# EAGLE schematic Led_Driver (EAGLE 6.4), part 1 of 2
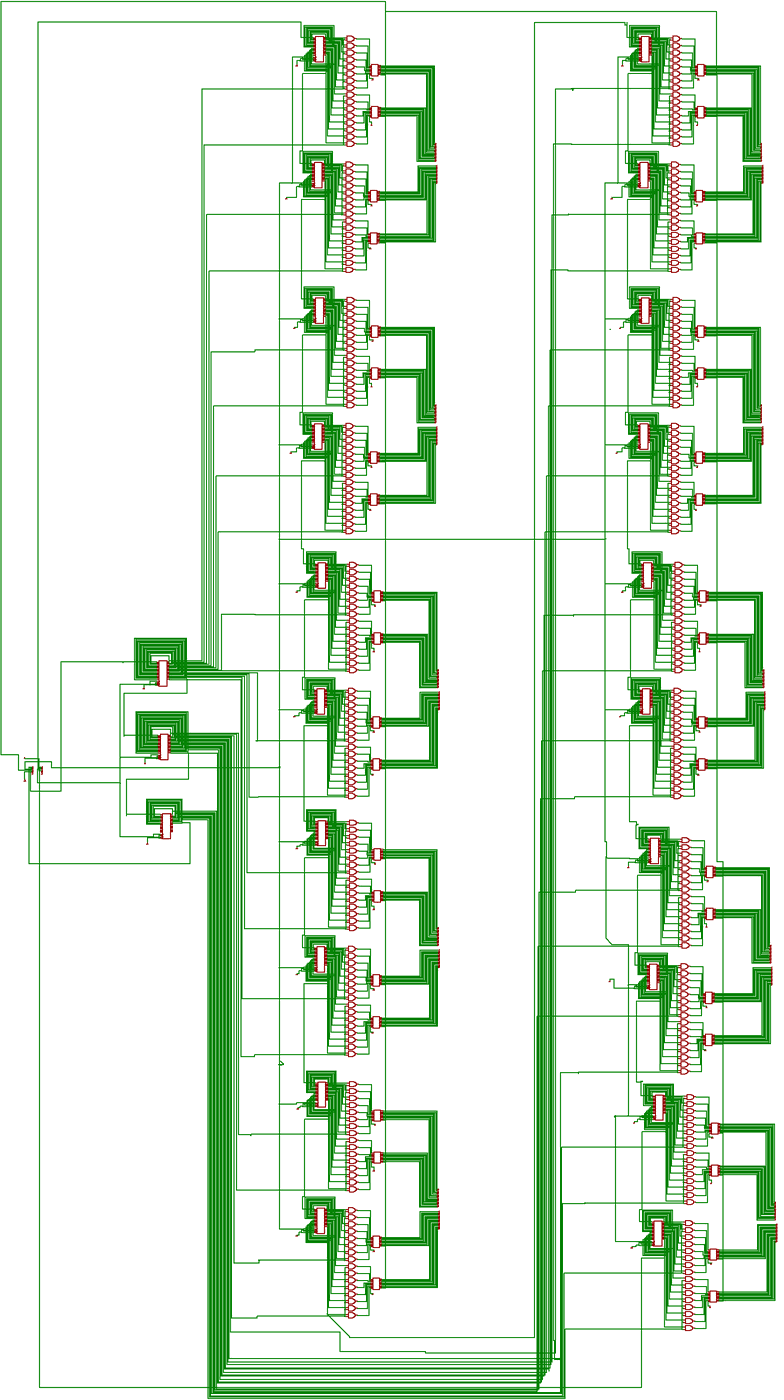
[diagram p0: schematic, sheet 1, overview]
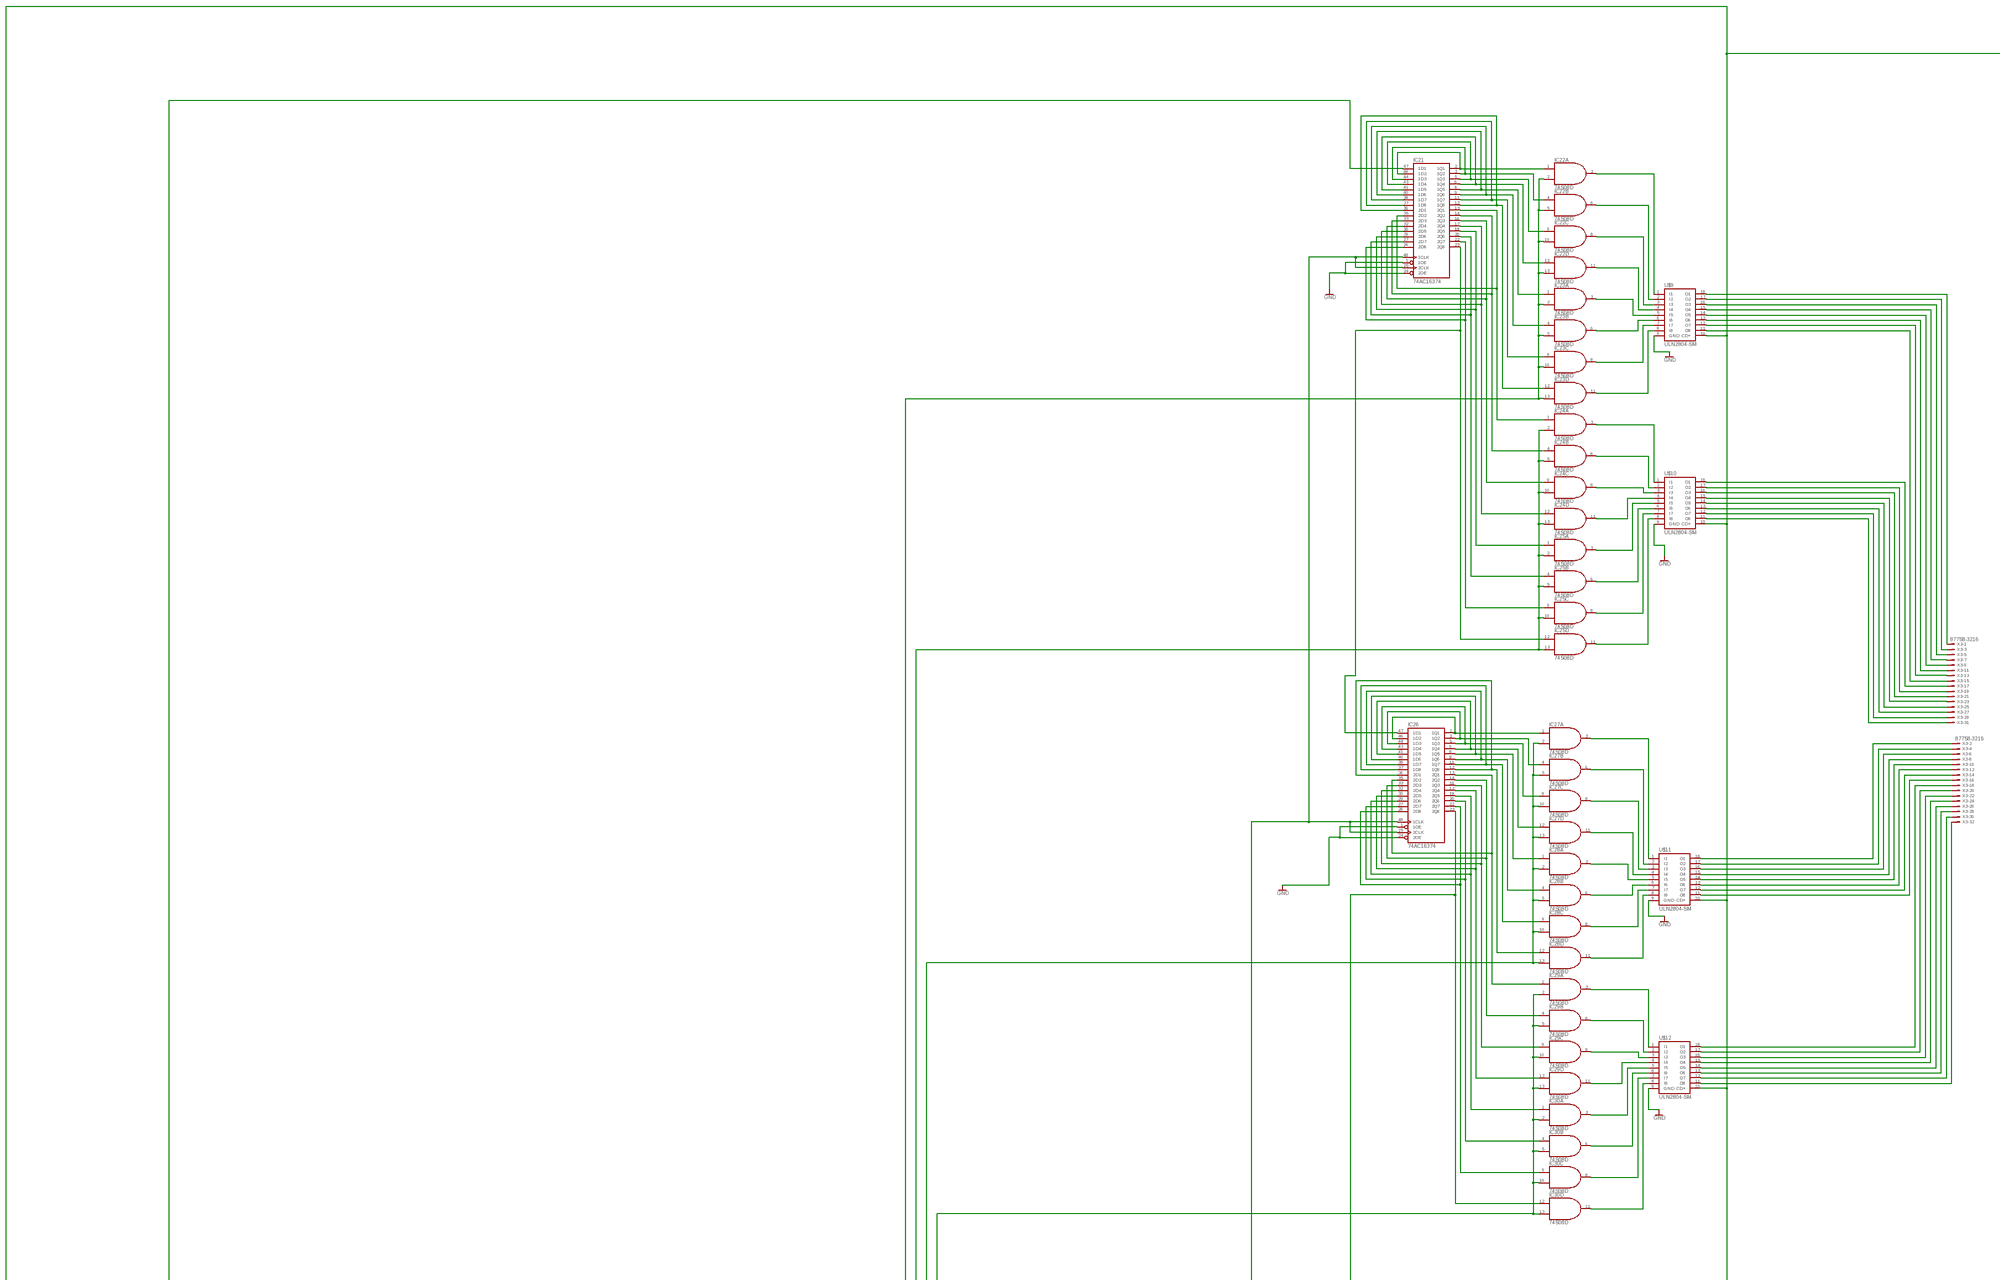
[diagram p1: schematic, sheet 1, part 1 of 8]
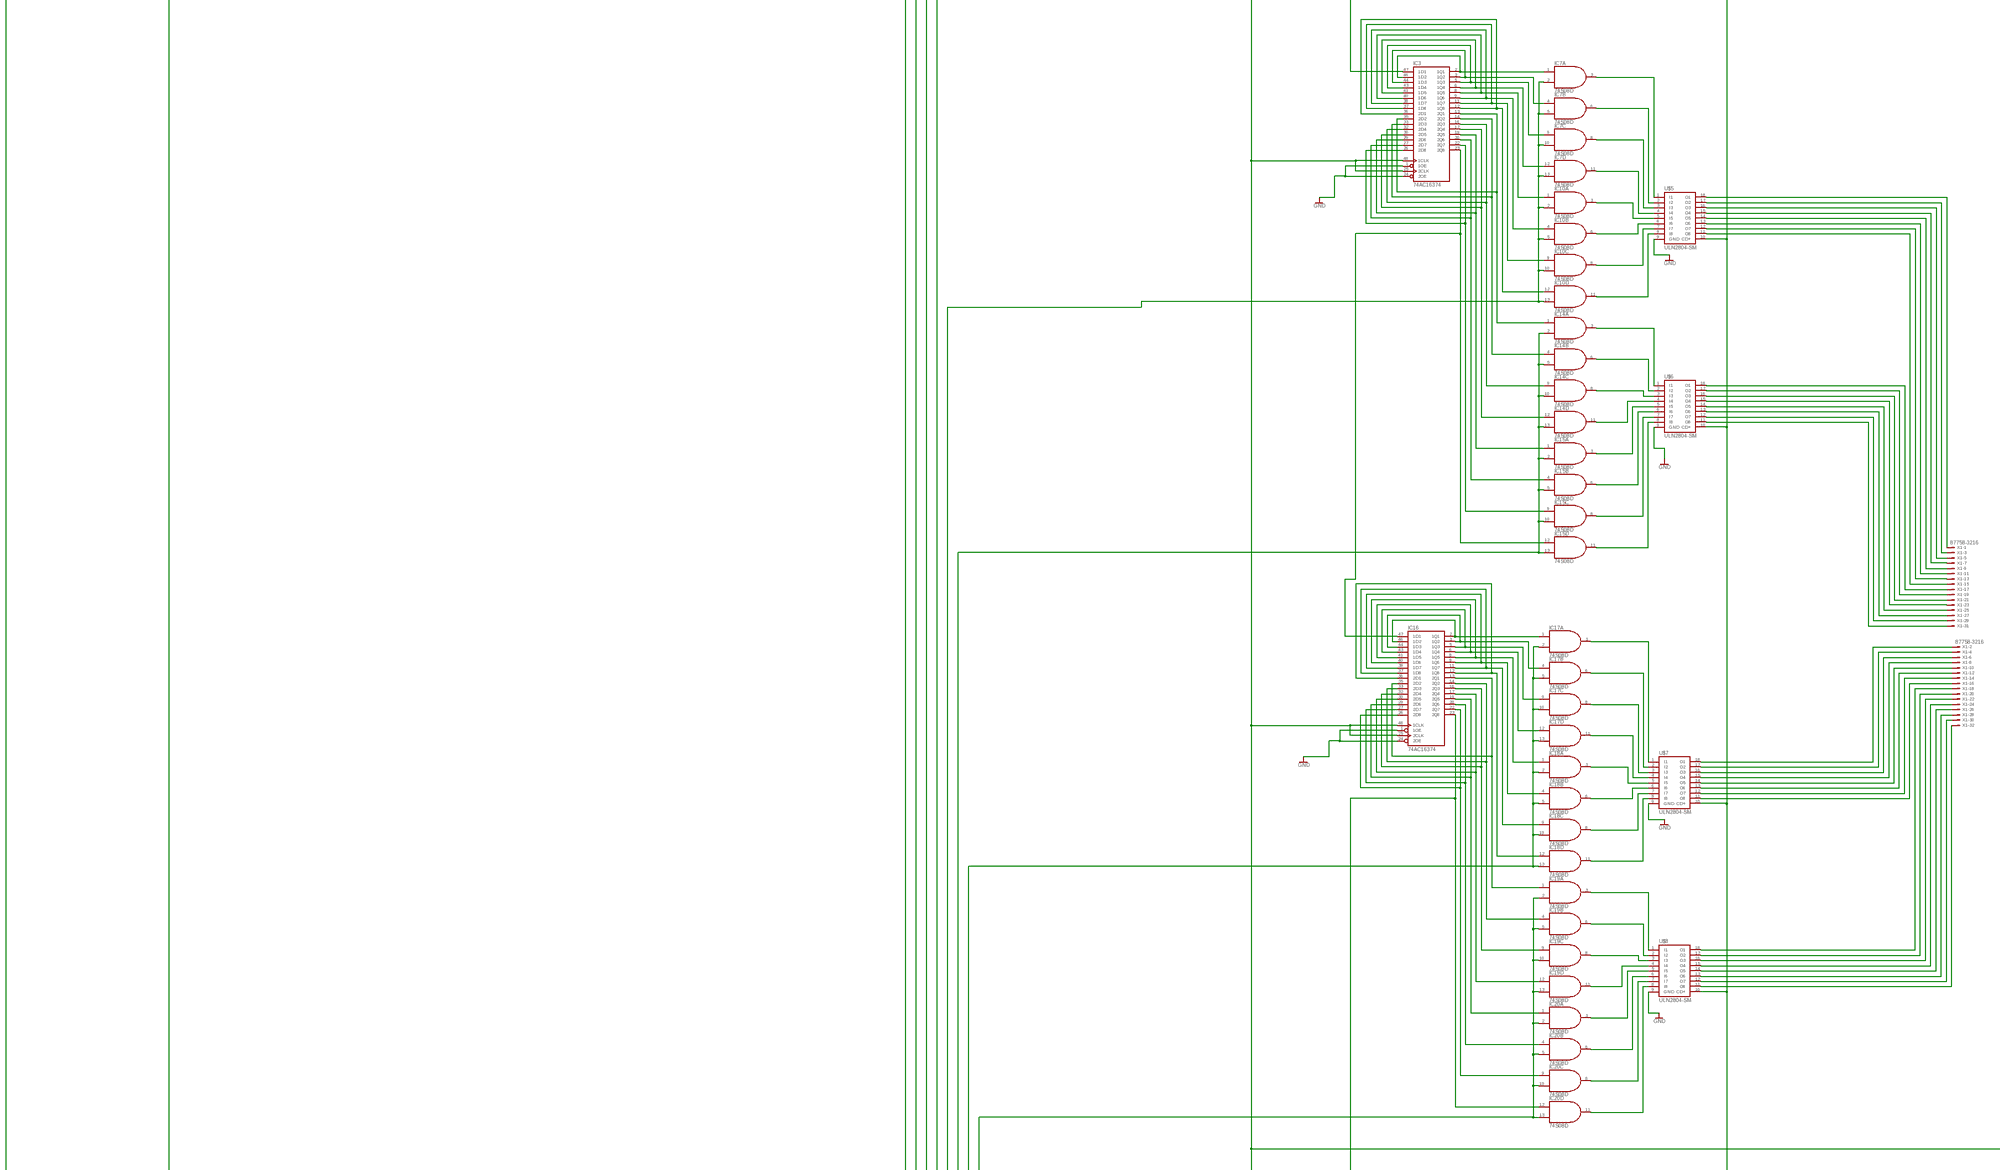
[diagram p2: schematic, sheet 1, part 2 of 8]
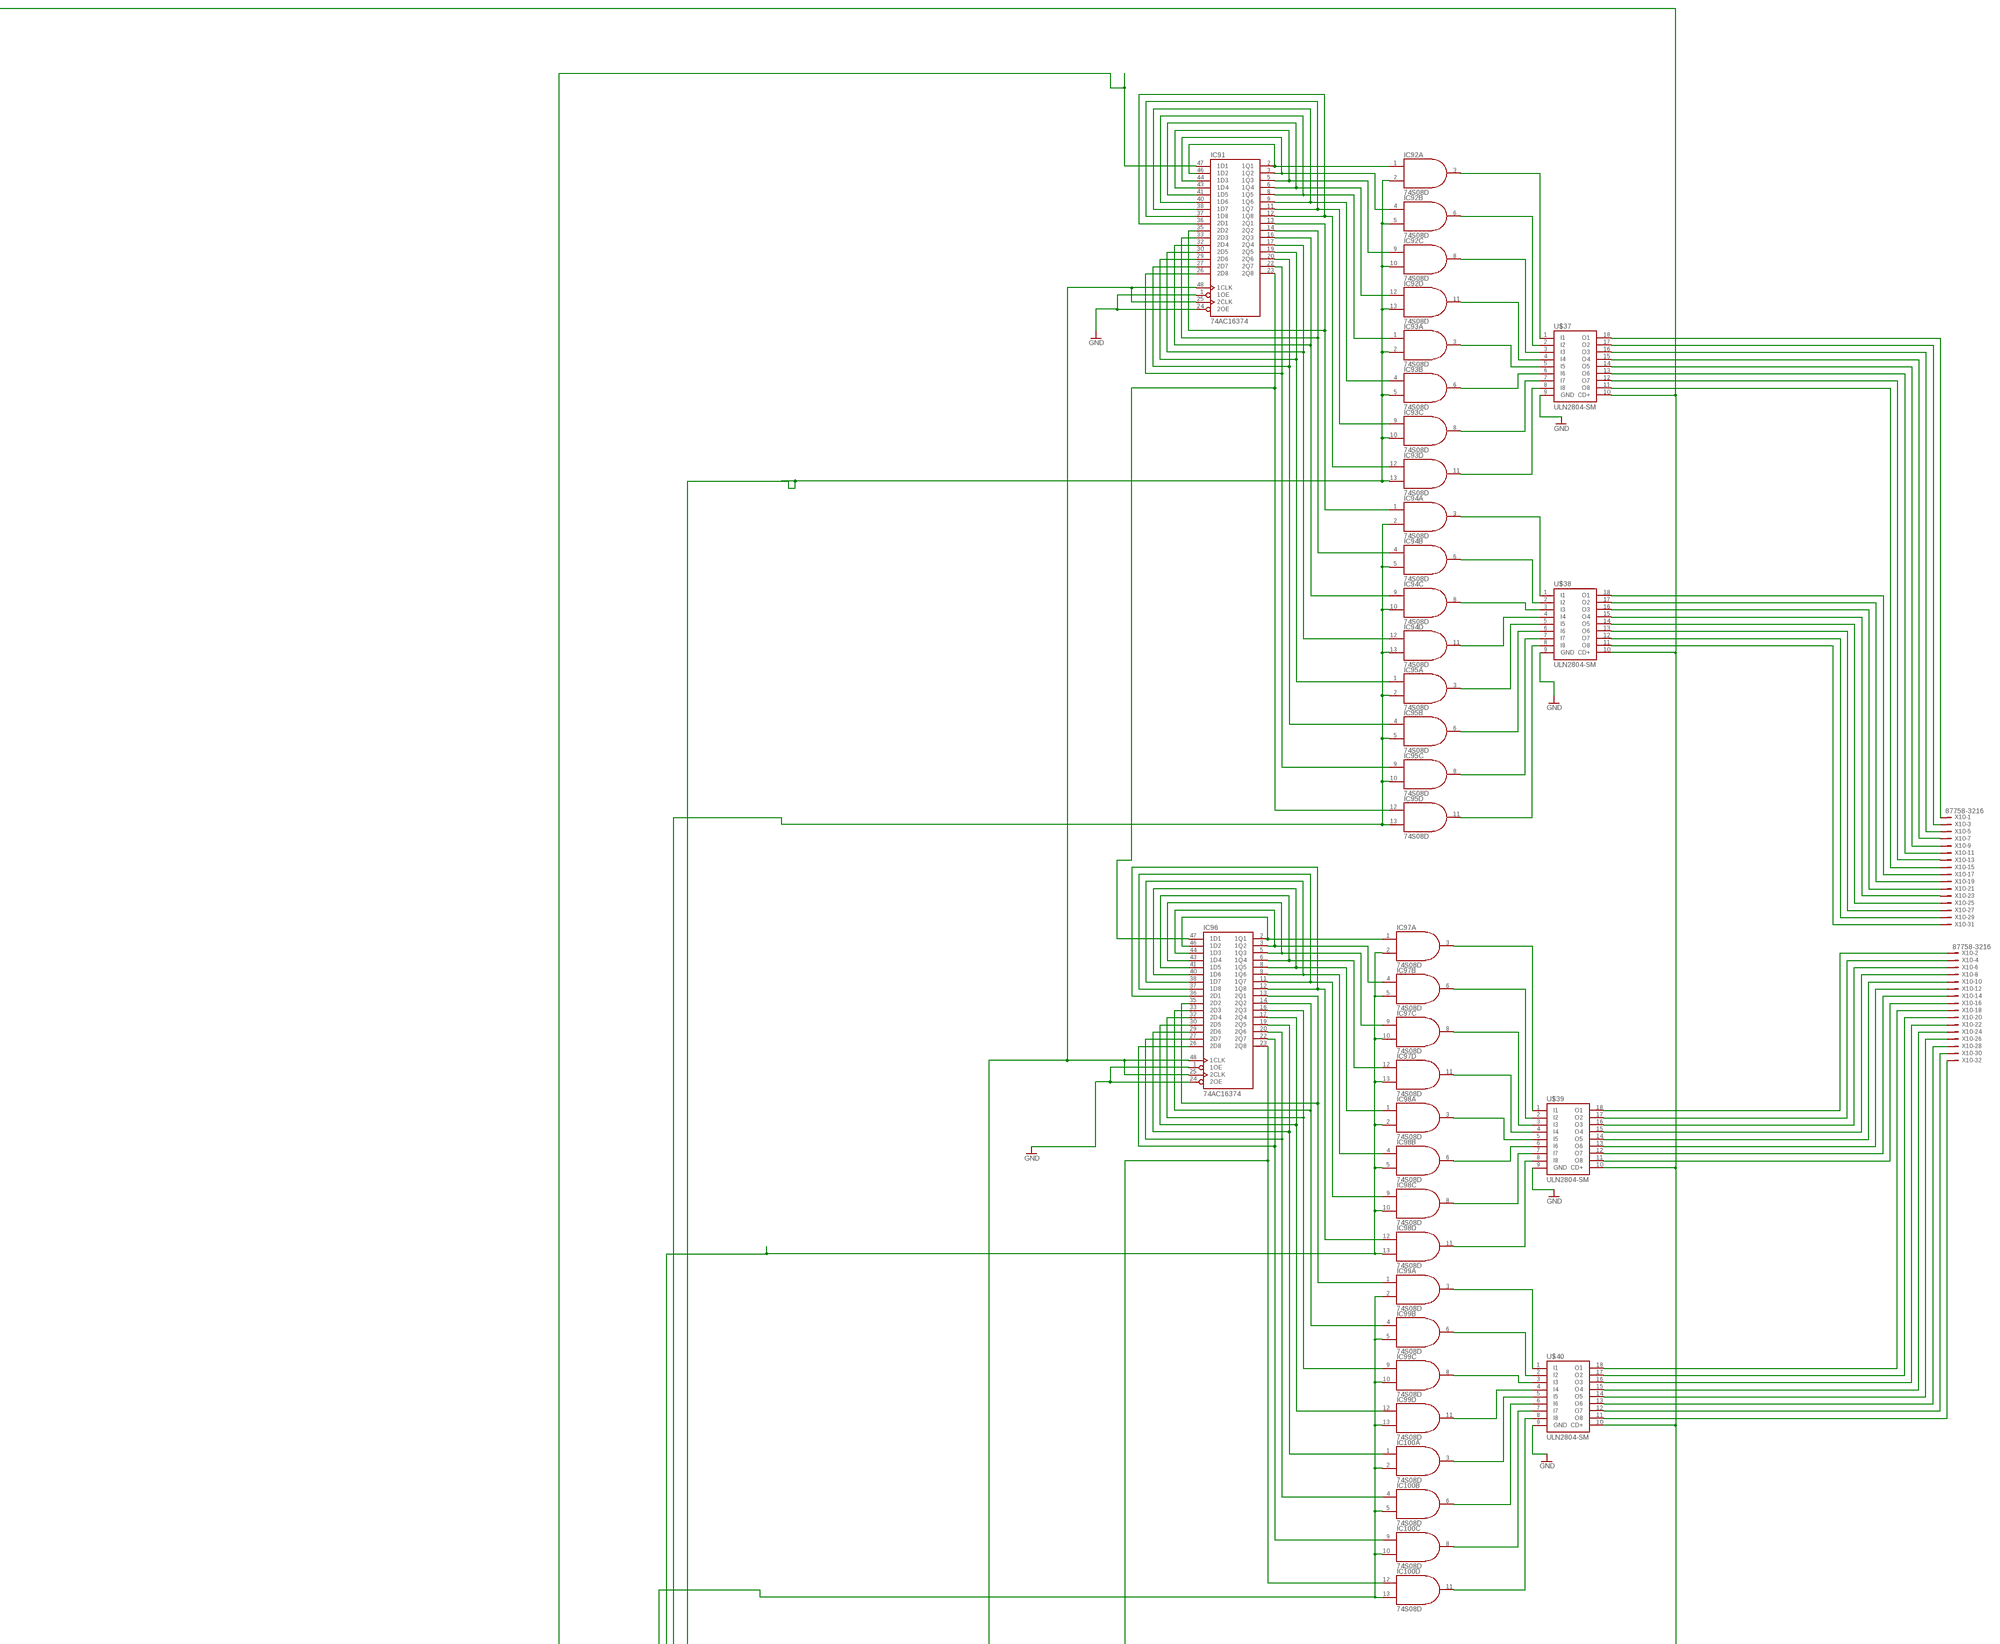
[diagram p3: schematic, sheet 1, part 3 of 8]
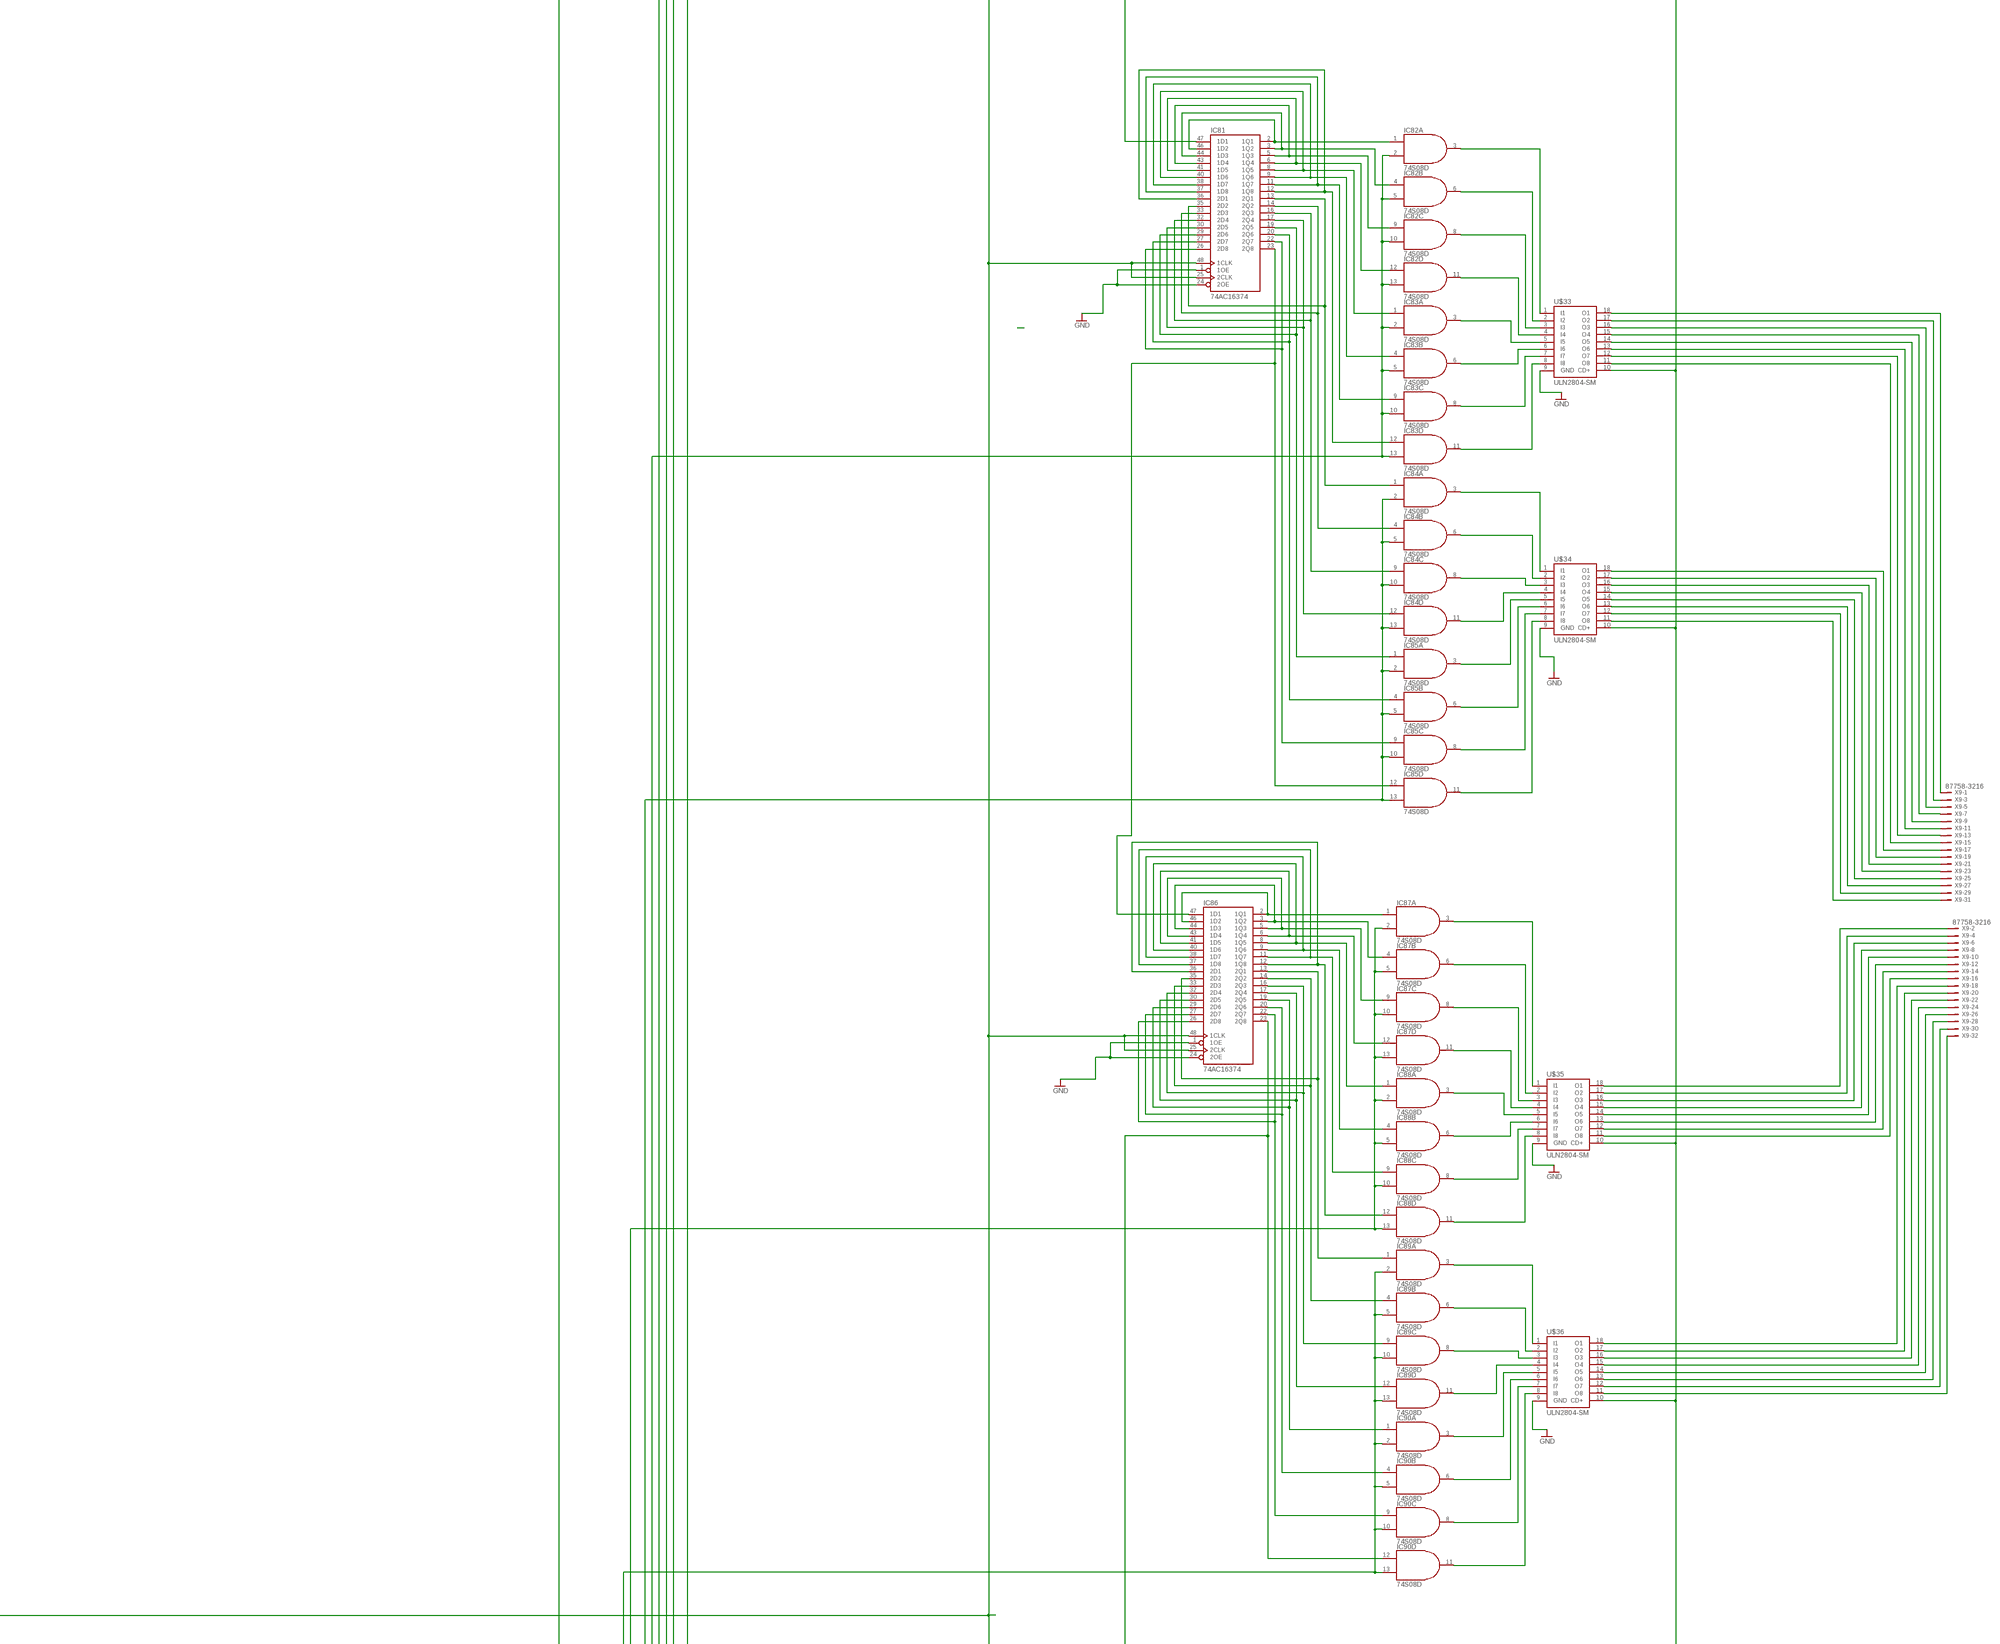
[diagram p4: schematic, sheet 1, part 4 of 8]
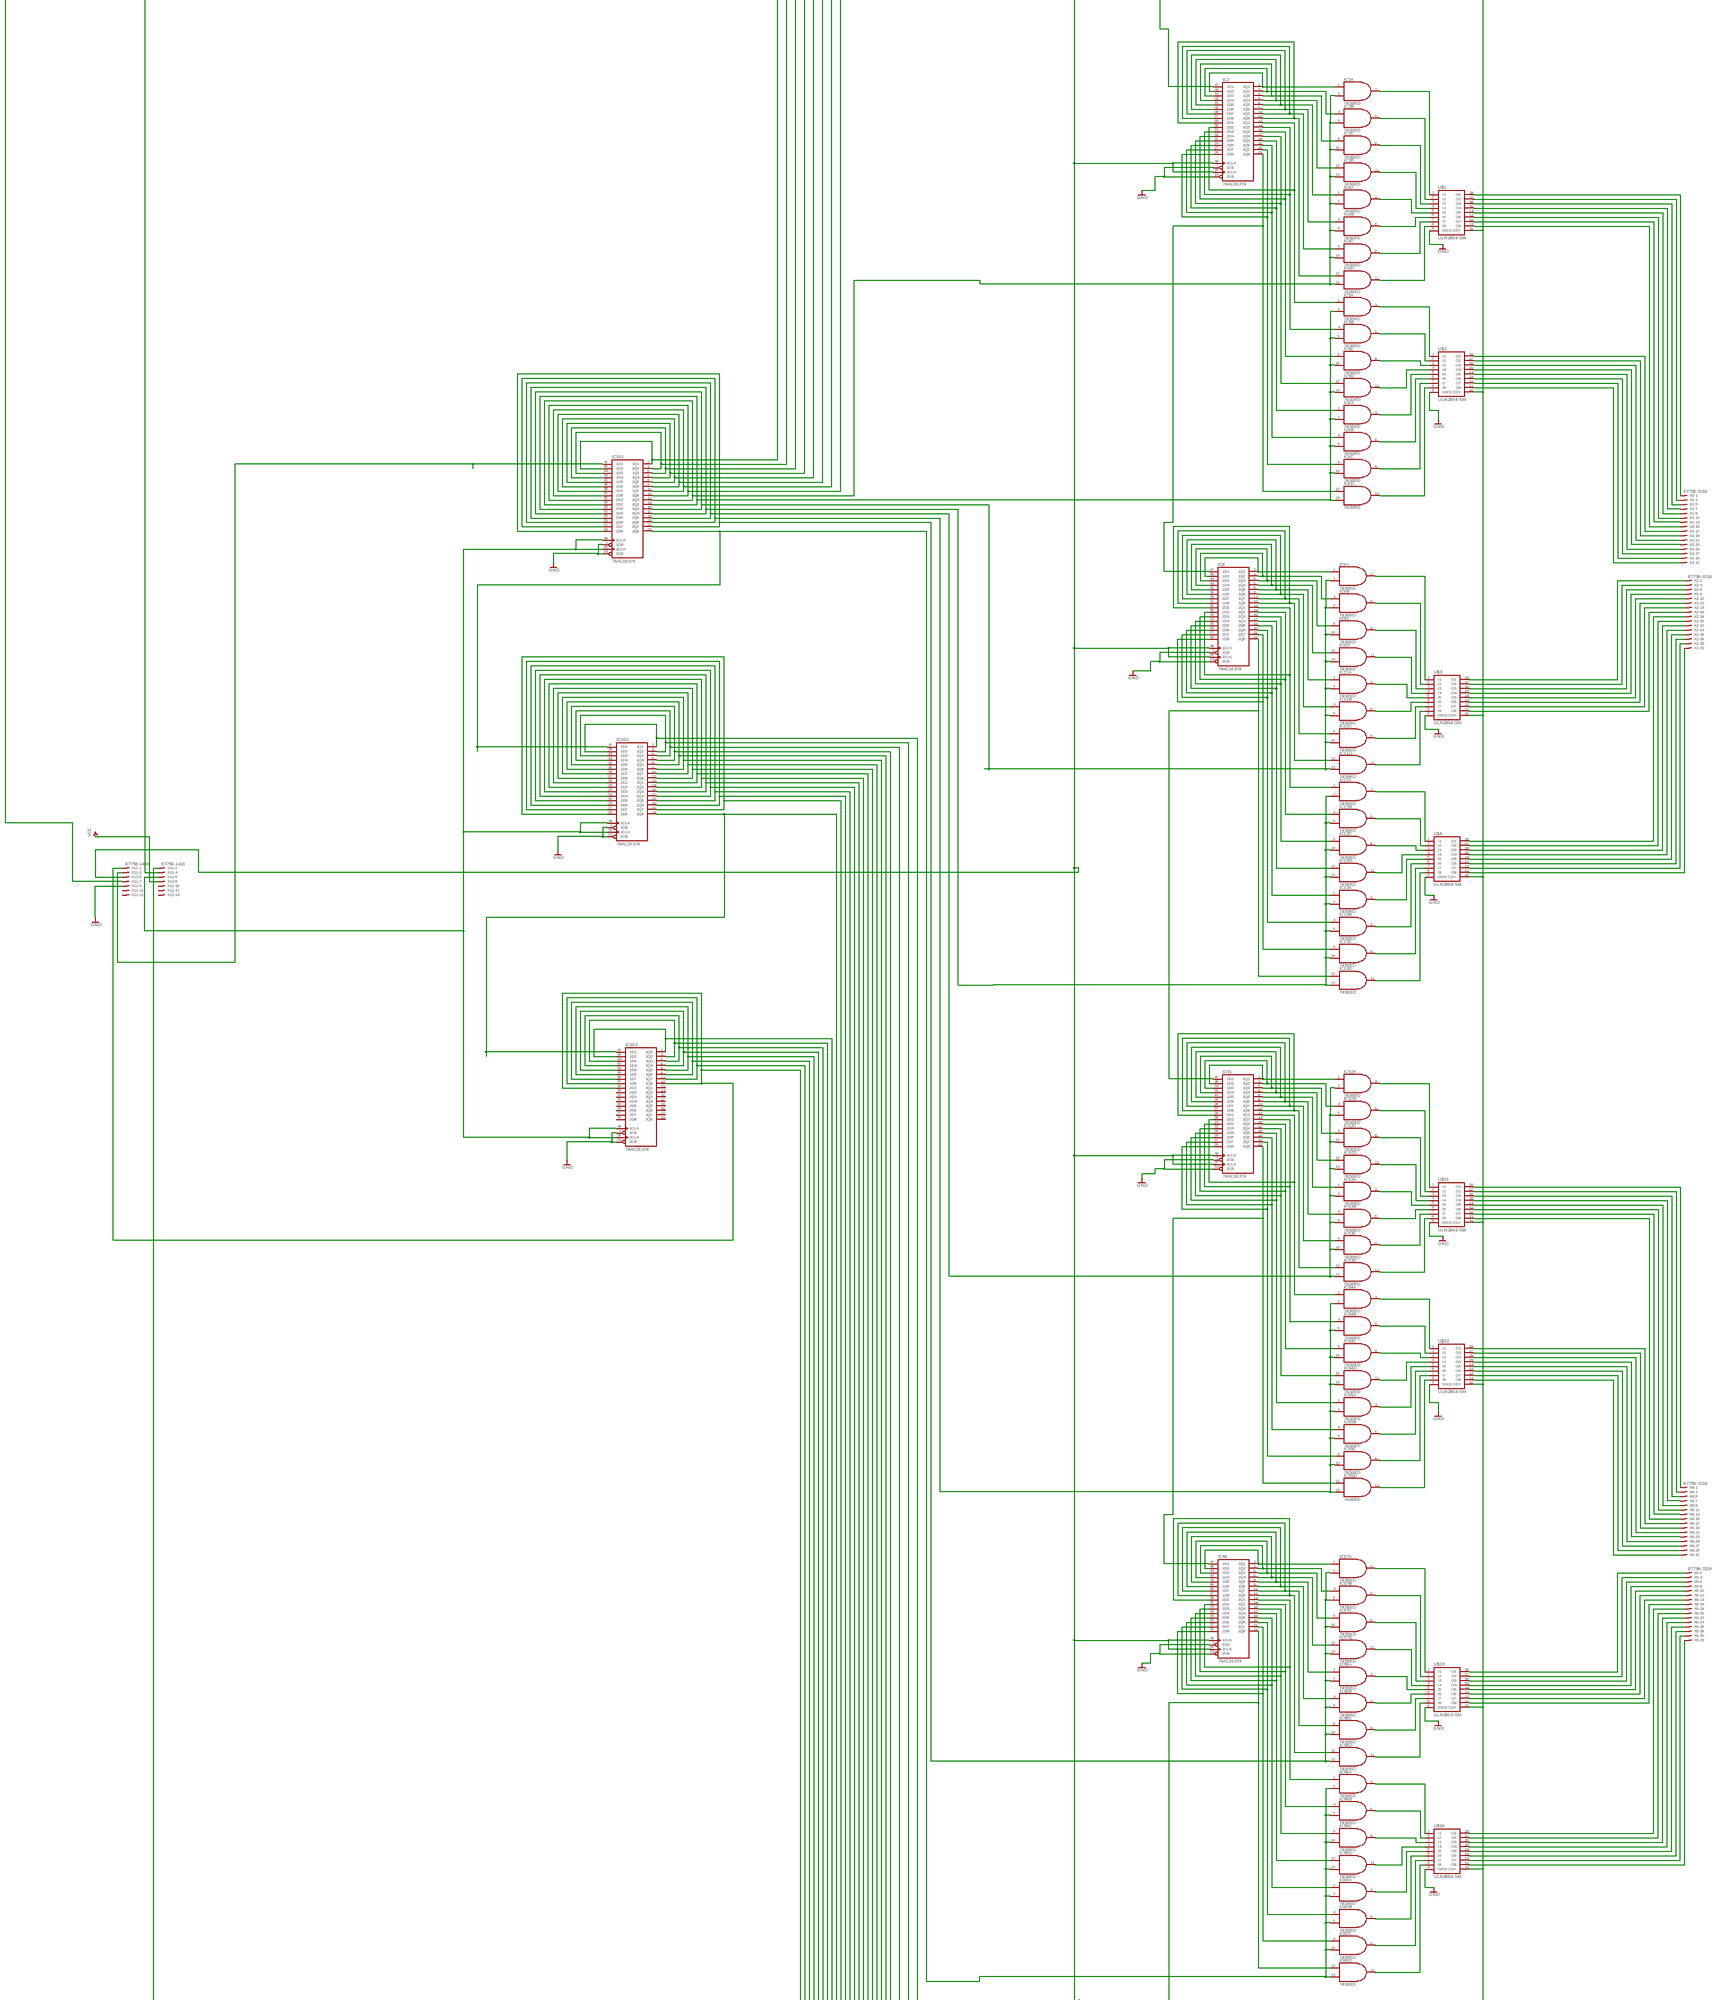
[diagram p5: schematic, sheet 1, part 5 of 8]
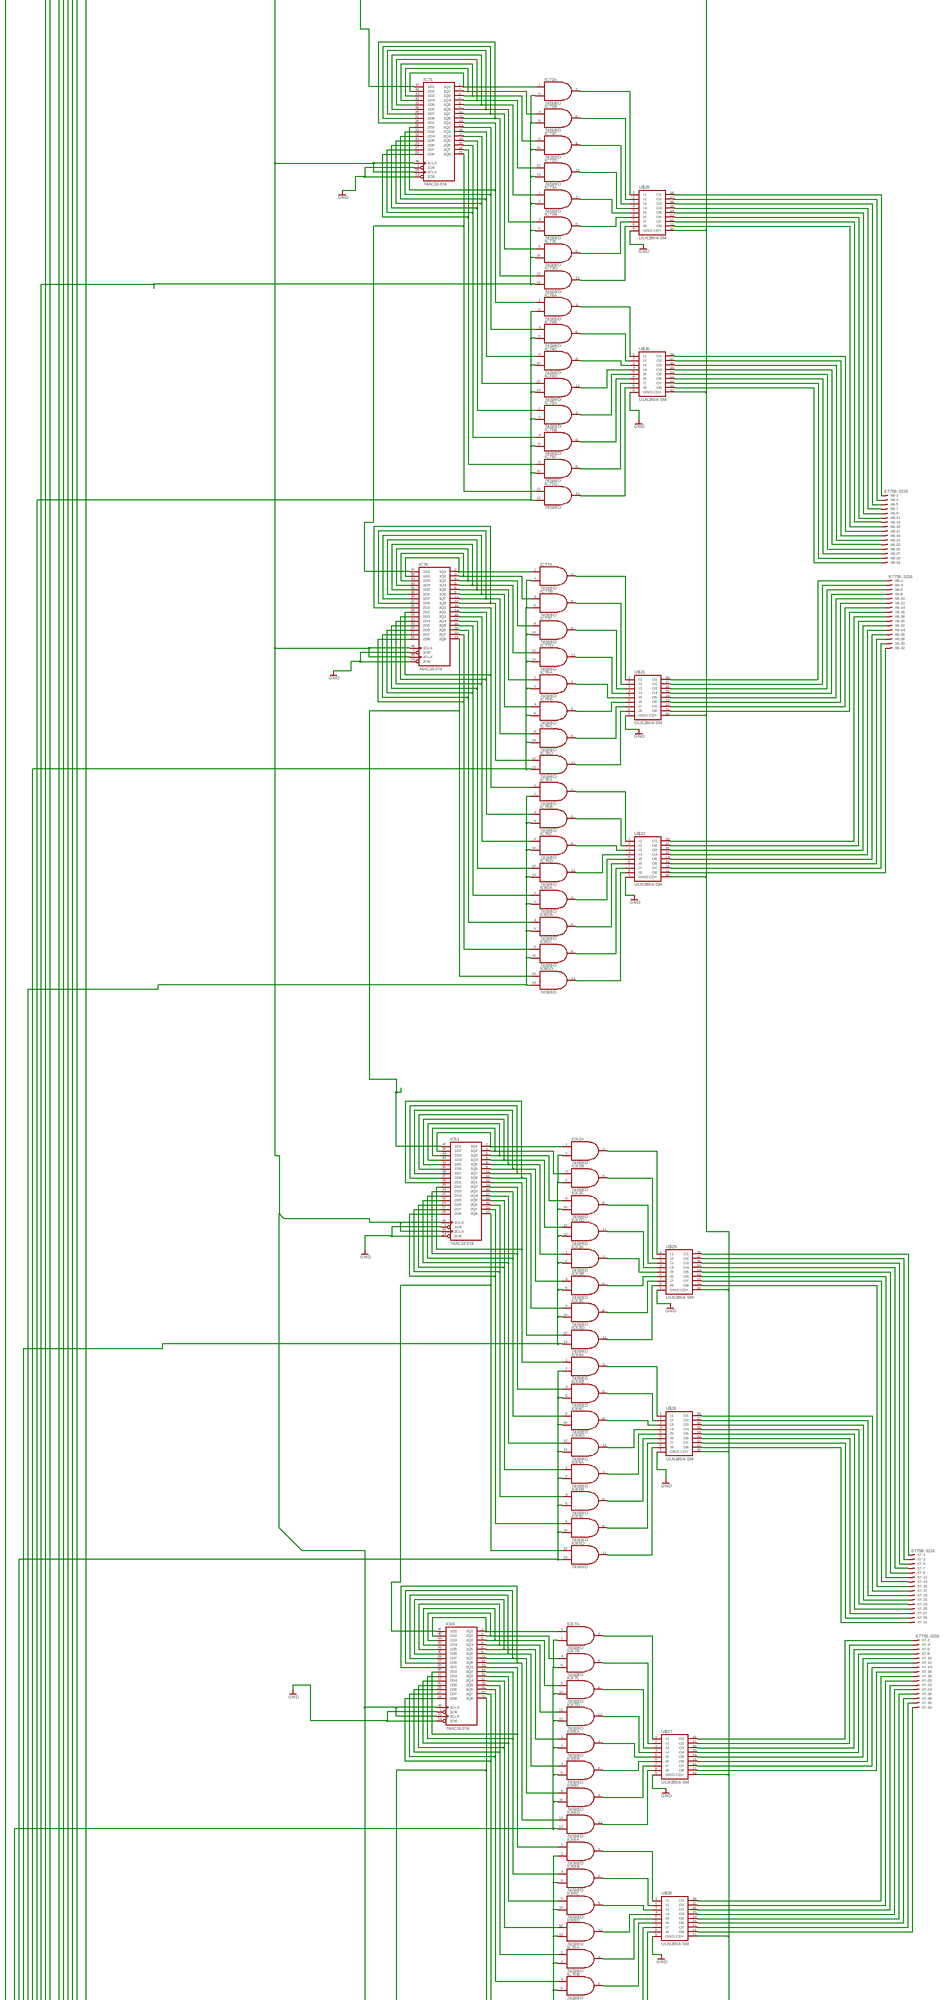
[diagram p6: schematic, sheet 1, part 6 of 8]
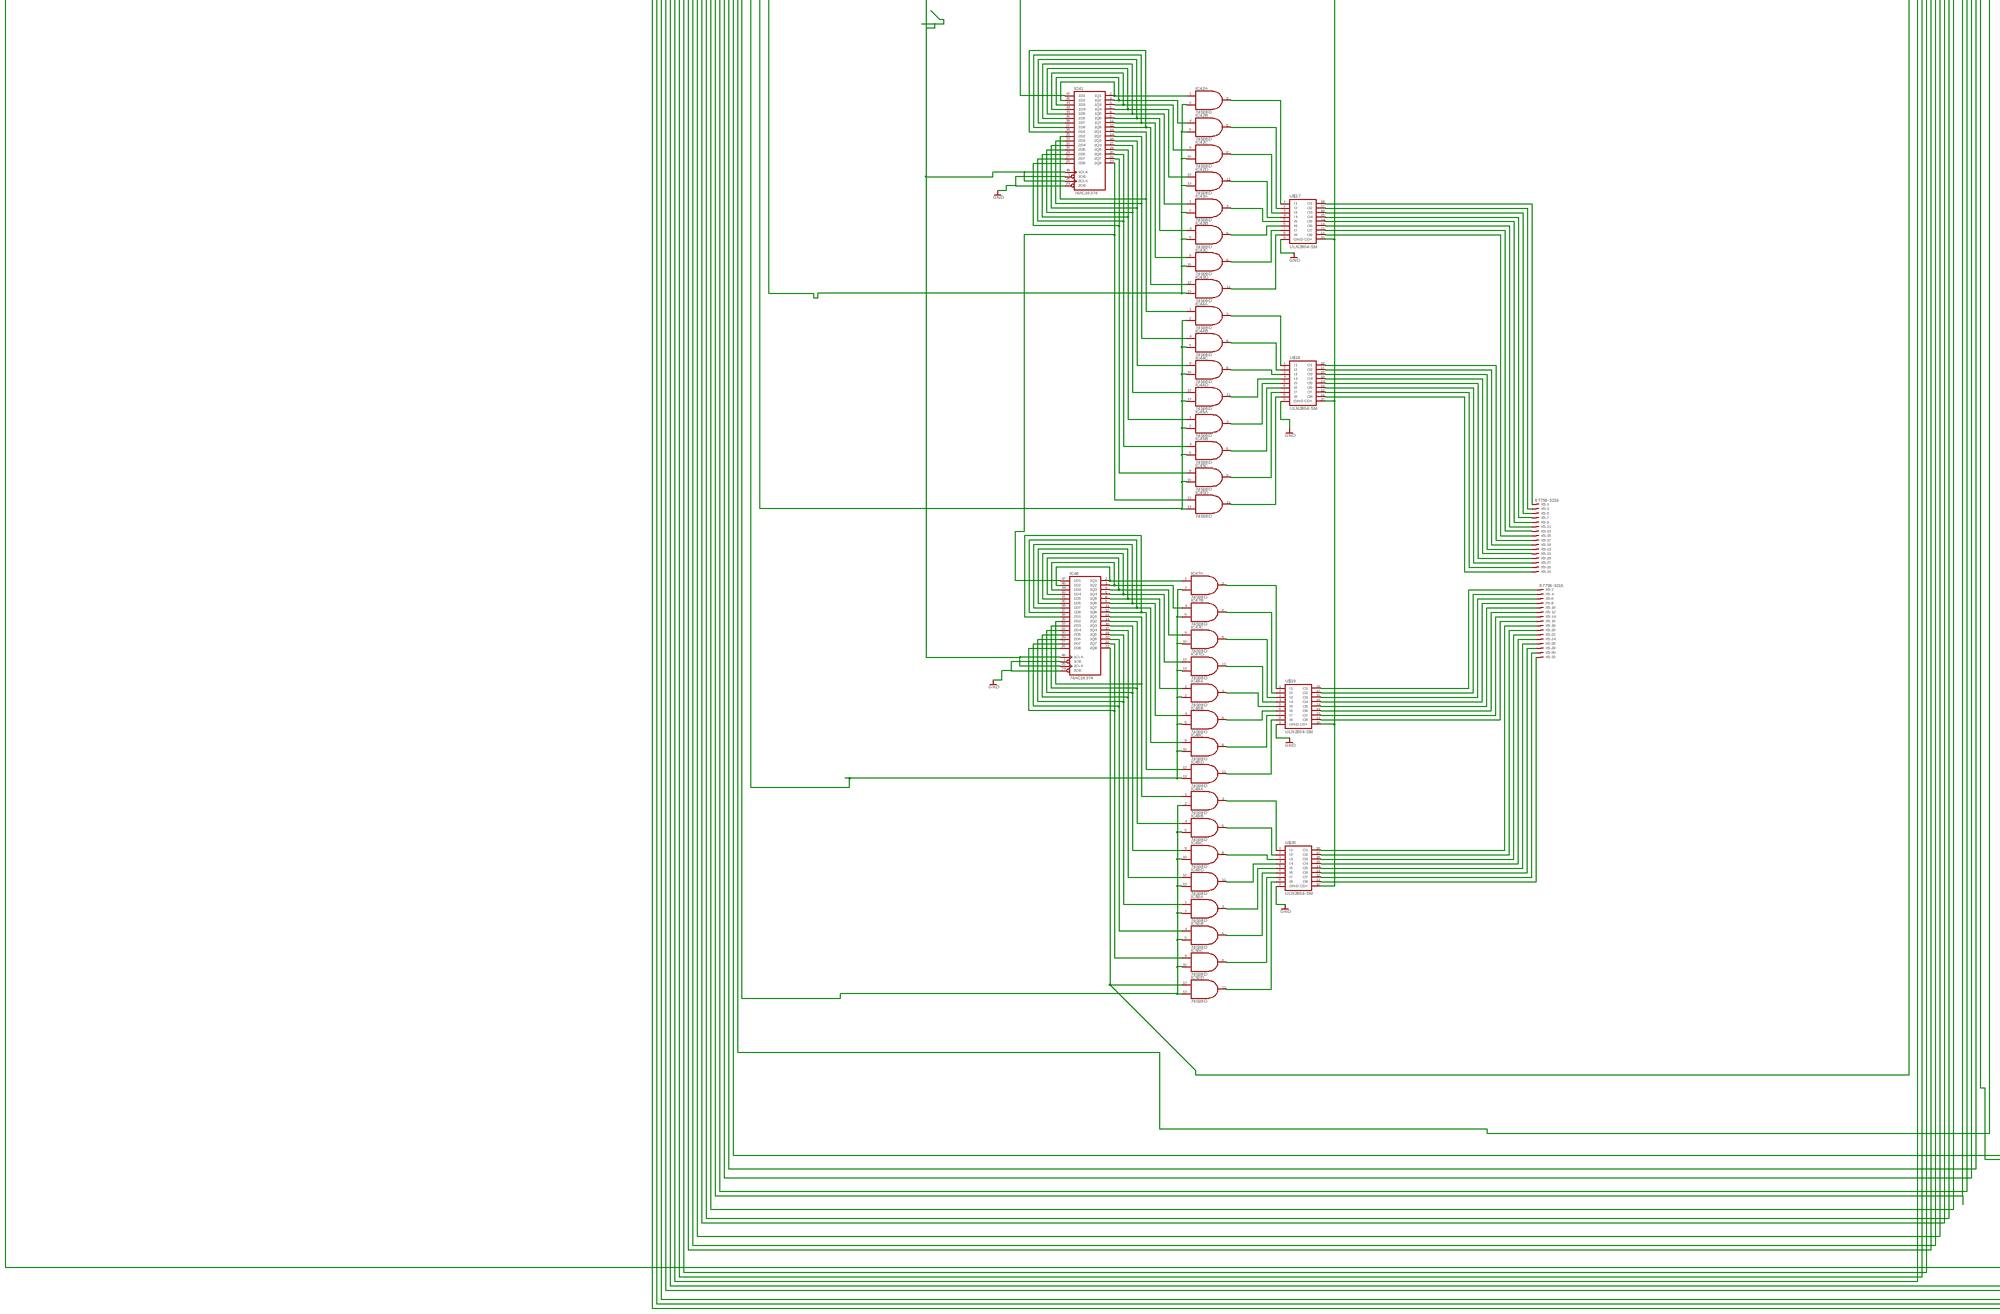
[diagram p7: schematic, sheet 1, part 7 of 8]
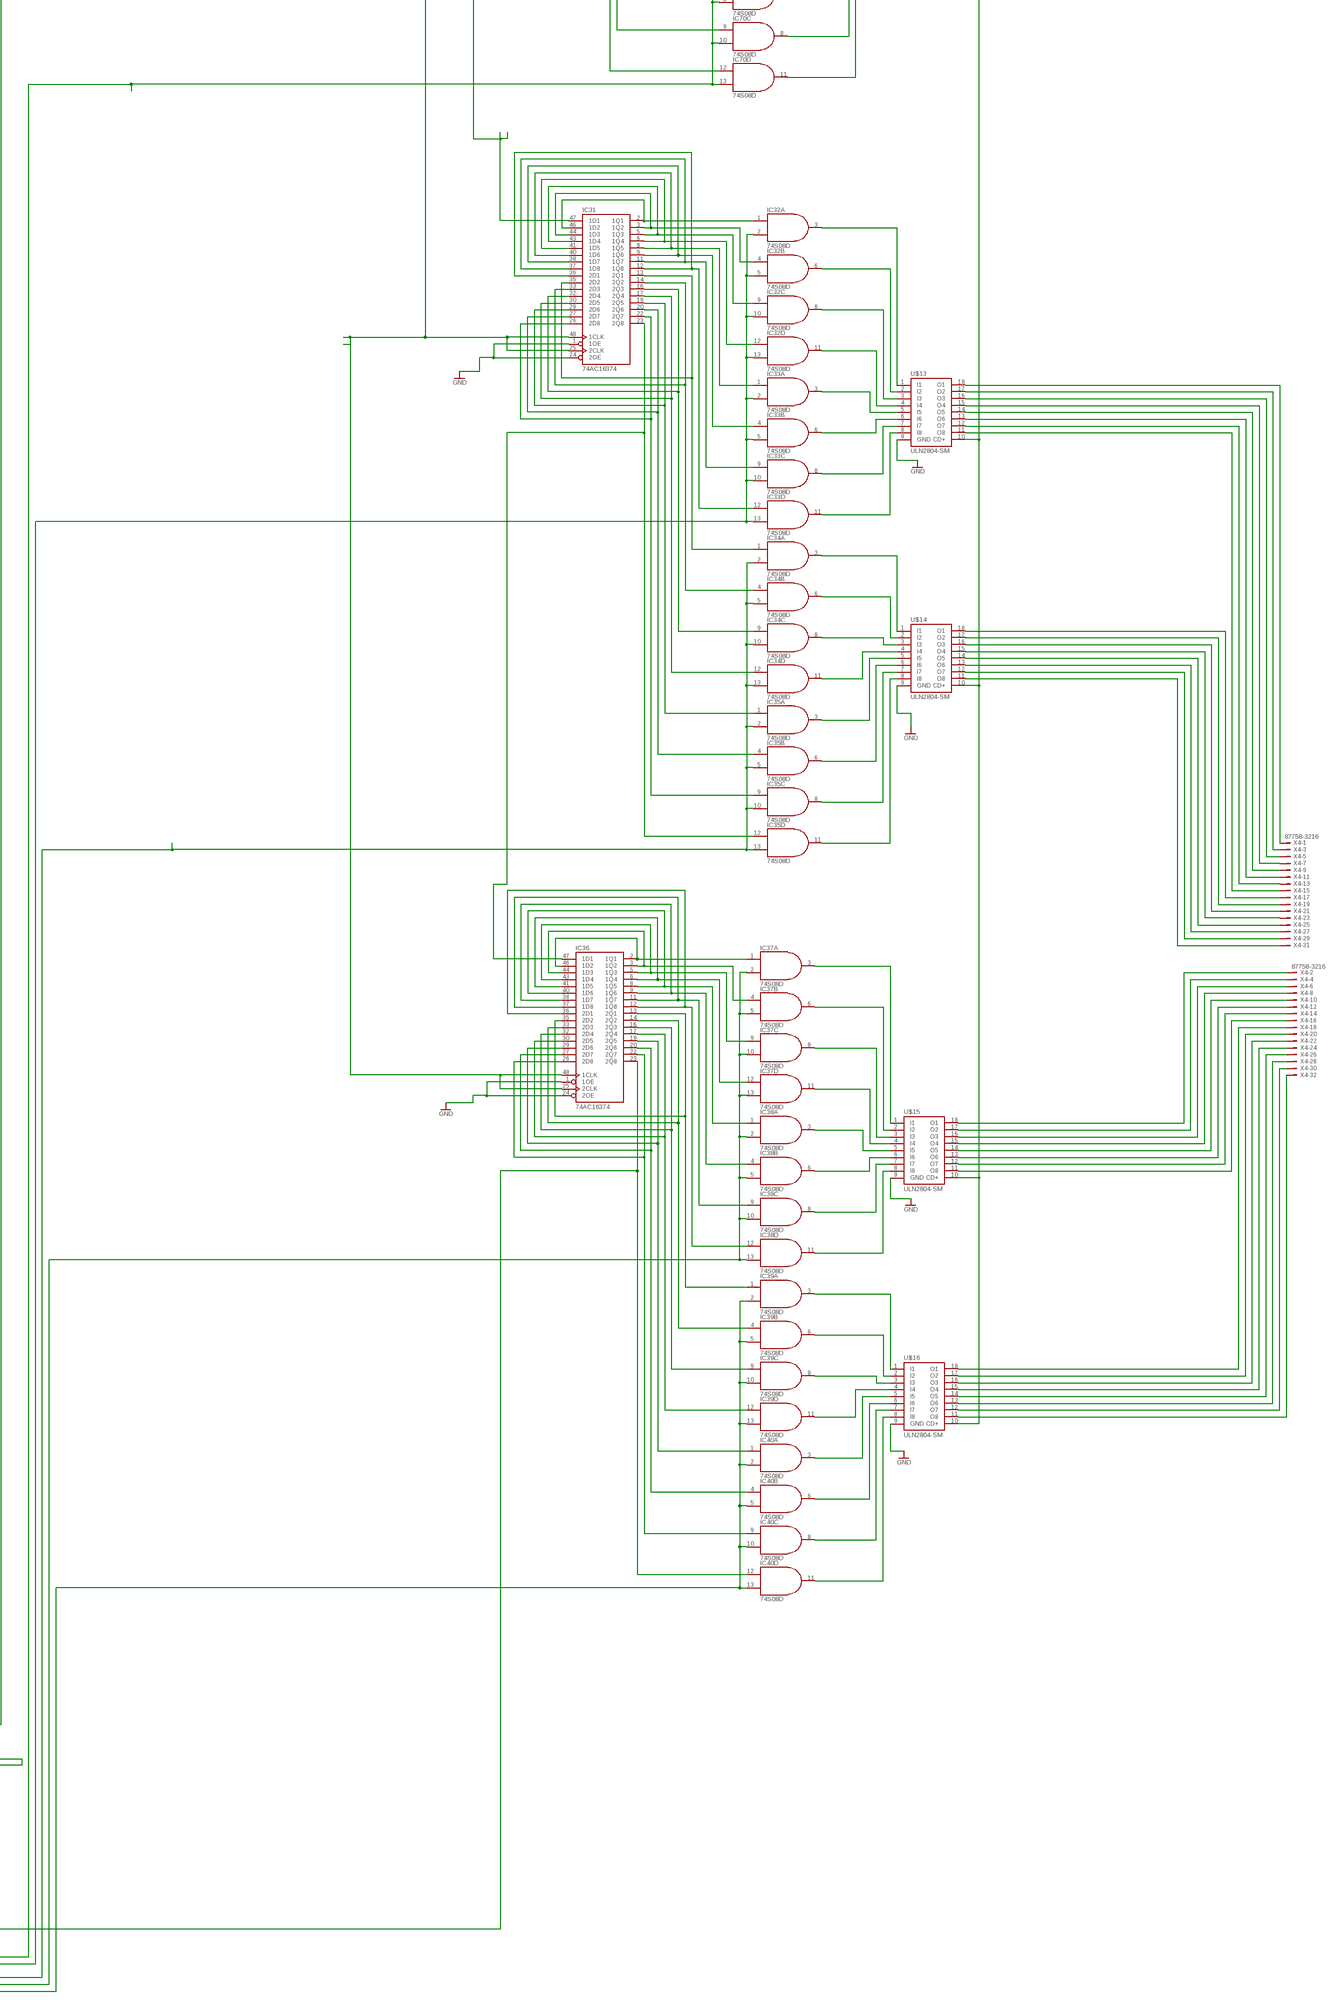
[diagram p8: schematic, sheet 1, part 8 of 8]

## Parts
IC1  74AC16374  [SSOP48DL]
IC2  74S08D  [SO14]
IC3  74AC16374  [SSOP48DL]
IC4  74S08D  [SO14]
IC5  74S08D  [SO14]
IC6  74S08D  [SO14]
IC7  74S08D  [SO14]
IC8  74AC16374  [SSOP48DL]
IC9  74S08D  [SO14]
IC10  74S08D  [SO14]
IC11  74S08D  [SO14]
IC12  74S08D  [SO14]
IC13  74S08D  [SO14]
IC14  74S08D  [SO14]
IC15  74S08D  [SO14]
IC16  74AC16374  [SSOP48DL]
IC17  74S08D  [SO14]
IC18  74S08D  [SO14]
IC19  74S08D  [SO14]
IC20  74S08D  [SO14]
IC21  74AC16374  [SSOP48DL]
IC22  74S08D  [SO14]
IC23  74S08D  [SO14]
IC24  74S08D  [SO14]
IC25  74S08D  [SO14]
IC26  74AC16374  [SSOP48DL]
IC27  74S08D  [SO14]
IC28  74S08D  [SO14]
IC29  74S08D  [SO14]
IC30  74S08D  [SO14]
IC31  74AC16374  [SSOP48DL]
IC32  74S08D  [SO14]
IC33  74S08D  [SO14]
IC34  74S08D  [SO14]
IC35  74S08D  [SO14]
IC36  74AC16374  [SSOP48DL]
IC37  74S08D  [SO14]
IC38  74S08D  [SO14]
IC39  74S08D  [SO14]
IC40  74S08D  [SO14]
IC41  74AC16374  [SSOP48DL]
IC42  74S08D  [SO14]
IC43  74S08D  [SO14]
IC44  74S08D  [SO14]
IC45  74S08D  [SO14]
IC46  74AC16374  [SSOP48DL]
IC47  74S08D  [SO14]
IC48  74S08D  [SO14]
IC49  74S08D  [SO14]
IC50  74S08D  [SO14]
IC51  74AC16374  [SSOP48DL]
IC52  74S08D  [SO14]
IC53  74S08D  [SO14]
IC54  74S08D  [SO14]
IC55  74S08D  [SO14]
IC56  74AC16374  [SSOP48DL]
IC57  74S08D  [SO14]
IC58  74S08D  [SO14]
IC59  74S08D  [SO14]
IC60  74S08D  [SO14]
IC61  74AC16374  [SSOP48DL]
IC62  74S08D  [SO14]
IC63  74S08D  [SO14]
IC64  74S08D  [SO14]
IC65  74S08D  [SO14]
IC66  74AC16374  [SSOP48DL]
IC67  74S08D  [SO14]
IC68  74S08D  [SO14]
IC69  74S08D  [SO14]
IC70  74S08D  [SO14]
IC71  74AC16374  [SSOP48DL]
IC72  74S08D  [SO14]
IC73  74S08D  [SO14]
IC74  74S08D  [SO14]
IC75  74S08D  [SO14]
IC76  74AC16374  [SSOP48DL]
IC77  74S08D  [SO14]
IC78  74S08D  [SO14]
IC79  74S08D  [SO14]
IC80  74S08D  [SO14]
IC81  74AC16374  [SSOP48DL]
IC82  74S08D  [SO14]
IC83  74S08D  [SO14]
IC84  74S08D  [SO14]
IC85  74S08D  [SO14]
IC86  74AC16374  [SSOP48DL]
IC87  74S08D  [SO14]
IC88  74S08D  [SO14]
IC89  74S08D  [SO14]
IC90  74S08D  [SO14]
IC91  74AC16374  [SSOP48DL]
IC92  74S08D  [SO14]
IC93  74S08D  [SO14]
IC94  74S08D  [SO14]
IC95  74S08D  [SO14]
IC96  74AC16374  [SSOP48DL]
IC97  74S08D  [SO14]
IC98  74S08D  [SO14]
IC99  74S08D  [SO14]
IC100  74S08D  [SO14]
IC101  74AC16374  [SSOP48DL]
IC102  74AC16374  [SSOP48DL]
IC103  74AC16374  [SSOP48DL]
U$1  ULN2804-SM  [SOP-18]
U$2  ULN2804-SM  [SOP-18]
U$3  ULN2804-SM  [SOP-18]
U$4  ULN2804-SM  [SOP-18]
U$5  ULN2804-SM  [SOP-18]
U$6  ULN2804-SM  [SOP-18]
U$7  ULN2804-SM  [SOP-18]
U$8  ULN2804-SM  [SOP-18]
U$9  ULN2804-SM  [SOP-18]
U$10  ULN2804-SM  [SOP-18]
U$11  ULN2804-SM  [SOP-18]
U$12  ULN2804-SM  [SOP-18]
U$13  ULN2804-SM  [SOP-18]
U$14  ULN2804-SM  [SOP-18]
U$15  ULN2804-SM  [SOP-18]
U$16  ULN2804-SM  [SOP-18]
U$17  ULN2804-SM  [SOP-18]
U$18  ULN2804-SM  [SOP-18]
U$19  ULN2804-SM  [SOP-18]
U$20  ULN2804-SM  [SOP-18]
U$21  ULN2804-SM  [SOP-18]
U$22  ULN2804-SM  [SOP-18]
U$23  ULN2804-SM  [SOP-18]
U$24  ULN2804-SM  [SOP-18]
U$25  ULN2804-SM  [SOP-18]
U$26  ULN2804-SM  [SOP-18]
U$27  ULN2804-SM  [SOP-18]
U$28  ULN2804-SM  [SOP-18]
U$29  ULN2804-SM  [SOP-18]
U$30  ULN2804-SM  [SOP-18]
U$31  ULN2804-SM  [SOP-18]
U$32  ULN2804-SM  [SOP-18]
U$33  ULN2804-SM  [SOP-18]
U$34  ULN2804-SM  [SOP-18]
U$35  ULN2804-SM  [SOP-18]
U$36  ULN2804-SM  [SOP-18]
U$37  ULN2804-SM  [SOP-18]
U$38  ULN2804-SM  [SOP-18]
U$39  ULN2804-SM  [SOP-18]
U$40  ULN2804-SM  [SOP-18]
X1  87758-3216  [87758-3216]
X2  87758-3216  [87758-3216]
X3  87758-3216  [87758-3216]
X4  87758-3216  [87758-3216]
X5  87758-3216  [87758-3216]
X6  87758-3216  [87758-3216]
X7  87758-3216  [87758-3216]
X8  87758-3216  [87758-3216]
X9  87758-3216  [87758-3216]
X10  87758-3216  [87758-3216]
X11  87758-1416  [87758-1416]

## Nets
GND: IC1.1(1OE) IC1.24(2OE) IC3.1(1OE) IC3.24(2OE) IC8.1(1OE) IC8.24(2OE) IC16.1(1OE) IC16.24(2OE) IC21.1(1OE) IC21.24(2OE) IC26.1(1OE) IC26.24(2OE) IC31.1(1OE) IC31.24(2OE) IC36.1(1OE) IC36.24(2OE) IC41.1(1OE) IC41.24(2OE) IC46.1(1OE) IC46.24(2OE) IC51.1(1OE) IC51.24(2OE) IC56.1(1OE) IC56.24(2OE) IC61.1(1OE) IC61.24(2OE) IC66.1(1OE) IC66.24(2OE) IC71.1(1OE) IC71.24(2OE) IC76.1(1OE) IC76.24(2OE) IC81.1(1OE) IC81.24(2OE) IC86.1(1OE) IC86.24(2OE) IC91.1(1OE) IC91.24(2OE) IC96.1(1OE) IC96.24(2OE) IC101.1(1OE) IC101.24(2OE) IC102.1(1OE) IC102.24(2OE) IC103.1(1OE) IC103.24(2OE) U$1.9(GND) U$2.9(GND) U$3.9(GND) U$4.9(GND) U$5.9(GND) U$6.9(GND) U$7.9(GND) U$8.9(GND) U$9.9(GND) U$10.9(GND) U$11.9(GND) U$12.9(GND) U$13.9(GND) U$14.9(GND) U$15.9(GND) U$16.9(GND) U$17.9(GND) U$18.9(GND) U$19.9(GND) U$20.9(GND) U$21.9(GND) U$22.9(GND) U$23.9(GND) U$24.9(GND) U$25.9(GND) U$26.9(GND) U$27.9(GND) U$28.9(GND) U$29.9(GND) U$30.9(GND) U$31.9(GND) U$32.9(GND) U$33.9(GND) U$34.9(GND) U$35.9(GND) U$36.9(GND) U$37.9(GND) U$38.9(GND) U$39.9(GND) U$40.9(GND) X11.9
N$2: IC1.2(1Q1) IC1.46(1D2) IC2.1(A:I0)
N$3: IC1.3(1Q2) IC1.44(1D3) IC2.4(B:I0)
N$4: IC1.5(1Q3) IC1.43(1D4) IC2.9(C:I0)
N$5: IC1.6(1Q4) IC1.41(1D5) IC2.12(D:I0)
N$6: IC1.8(1Q5) IC1.40(1D6) IC4.1(A:I0)
N$7: IC1.9(1Q6) IC1.38(1D7) IC4.4(B:I0)
N$8: IC1.11(1Q7) IC1.37(1D8) IC4.9(C:I0)
N$9: IC1.12(1Q8) IC1.36(2D1) IC4.12(D:I0)
N$10: IC1.13(2Q1) IC1.35(2D2) IC5.1(A:I0)
N$11: IC1.14(2Q2) IC1.33(2D3) IC5.4(B:I0)
N$12: IC1.16(2Q3) IC1.32(2D4) IC5.9(C:I0)
N$13: IC1.17(2Q4) IC1.30(2D5) IC5.12(D:I0)
N$14: IC1.19(2Q5) IC1.29(2D6) IC6.1(A:I0)
N$15: IC1.20(2Q6) IC1.27(2D7) IC6.4(B:I0)
N$16: IC1.22(2Q7) IC1.26(2D8) IC6.9(C:I0)
N$17: U$1.18(O1) X2.1
N$19: IC2.3(A:O) U$1.1(I1)
N$20: IC2.6(B:O) U$1.2(I2)
N$21: IC2.8(C:O) U$1.3(I3)
N$22: IC2.11(D:O) U$1.4(I4)
N$23: IC4.3(A:O) U$1.5(I5)
N$24: IC4.11(D:O) U$1.8(I8)
N$25: IC4.8(C:O) U$1.7(I7)
N$26: IC4.6(B:O) U$1.6(I6)
N$27: IC5.3(A:O) U$2.1(I1)
N$28: IC5.6(B:O) U$2.2(I2)
N$29: IC5.8(C:O) U$2.3(I3)
N$30: IC6.11(D:O) U$2.8(I8)
N$31: IC6.8(C:O) U$2.7(I7)
N$32: IC6.6(B:O) U$2.6(I6)
N$33: IC6.3(A:O) U$2.5(I5)
N$34: IC5.11(D:O) U$2.4(I4)
N$35: IC22.2(A:I1) IC22.5(B:I1) IC22.10(C:I1) IC22.13(D:I1) IC23.2(A:I1) IC23.5(B:I1) IC23.10(C:I1) IC23.13(D:I1) IC101.2(1Q1) IC101.46(1D2)
N$36: IC24.2(A:I1) IC24.5(B:I1) IC24.10(C:I1) IC24.13(D:I1) IC25.2(A:I1) IC25.5(B:I1) IC25.10(C:I1) IC25.13(D:I1) IC101.3(1Q2) IC101.44(1D3)
N$39: IC8.2(1Q1) IC8.46(1D2) IC9.1(A:I0)
N$40: IC8.3(1Q2) IC8.44(1D3) IC9.4(B:I0)
N$41: IC8.5(1Q3) IC8.43(1D4) IC9.9(C:I0)
N$42: IC8.6(1Q4) IC8.41(1D5) IC9.12(D:I0)
N$43: IC8.8(1Q5) IC8.40(1D6) IC11.1(A:I0)
N$44: IC8.9(1Q6) IC8.38(1D7) IC11.4(B:I0)
N$45: IC8.11(1Q7) IC8.37(1D8) IC11.9(C:I0)
N$46: IC8.12(1Q8) IC8.36(2D1) IC11.12(D:I0)
N$47: IC8.13(2Q1) IC8.35(2D2) IC12.1(A:I0)
N$48: IC8.14(2Q2) IC8.33(2D3) IC12.4(B:I0)
N$49: IC8.16(2Q3) IC8.32(2D4) IC12.9(C:I0)
N$50: IC8.17(2Q4) IC8.30(2D5) IC12.12(D:I0)
N$51: IC8.19(2Q5) IC8.29(2D6) IC13.1(A:I0)
N$52: IC8.20(2Q6) IC8.27(2D7) IC13.4(B:I0)
N$53: IC8.22(2Q7) IC8.26(2D8) IC13.9(C:I0)
N$54: IC8.23(2Q8) IC13.12(D:I0) IC51.47(1D1)
N$56: IC9.3(A:O) U$3.1(I1)
N$57: IC9.6(B:O) U$3.2(I2)
N$58: IC9.8(C:O) U$3.3(I3)
N$59: IC9.11(D:O) U$3.4(I4)
N$60: IC11.3(A:O) U$3.5(I5)
N$61: IC11.11(D:O) U$3.8(I8)
N$62: IC11.8(C:O) U$3.7(I7)
N$63: IC11.6(B:O) U$3.6(I6)
N$64: IC12.3(A:O) U$4.1(I1)
N$65: IC12.6(B:O) U$4.2(I2)
N$66: IC12.8(C:O) U$4.3(I3)
N$67: IC13.11(D:O) U$4.8(I8)
N$68: IC13.8(C:O) U$4.7(I7)
N$69: IC13.6(B:O) U$4.6(I6)
N$70: IC13.3(A:O) U$4.5(I5)
N$71: IC12.11(D:O) U$4.4(I4)
N$72: IC1.23(2Q8) IC6.12(D:I0) IC8.47(1D1)
N$73: IC71.2(1Q1) IC71.46(1D2) IC72.1(A:I0)
N$74: IC71.3(1Q2) IC71.44(1D3) IC72.4(B:I0)
N$75: U$1.17(O2) X2.3
N$76: U$1.16(O3) X2.5
N$77: U$1.15(O4) X2.7
N$78: U$1.14(O5) X2.9
N$79: U$1.13(O6) X2.11
N$80: U$1.12(O7) X2.13
N$81: U$1.11(O8) X2.15
N$82: U$2.18(O1) X2.17
N$83: U$2.17(O2) X2.19
N$84: U$2.16(O3) X2.21
N$85: U$2.15(O4) X2.23
N$86: U$2.14(O5) X2.25
N$87: U$2.13(O6) X2.27
N$88: U$2.12(O7) X2.29
N$89: U$2.11(O8) X2.31
N$90: U$4.11(O8) X2.32
N$91: U$4.12(O7) X2.30
N$92: U$4.13(O6) X2.28
N$93: U$4.14(O5) X2.26
N$94: U$4.15(O4) X2.24
N$95: U$4.16(O3) X2.22
N$96: U$4.17(O2) X2.20
N$97: U$4.18(O1) X2.18
N$98: U$3.11(O8) X2.16
N$99: U$3.12(O7) X2.14
N$100: U$3.13(O6) X2.12
N$101: U$3.14(O5) X2.10
N$102: U$3.15(O4) X2.8
N$103: U$3.16(O3) X2.6
N$104: U$3.17(O2) X2.4
N$105: U$3.18(O1) X2.2
N$107: IC3.2(1Q1) IC3.46(1D2) IC7.1(A:I0)
N$108: IC3.3(1Q2) IC3.44(1D3) IC7.4(B:I0)
N$109: IC3.5(1Q3) IC3.43(1D4) IC7.9(C:I0)
N$110: IC3.6(1Q4) IC3.41(1D5) IC7.12(D:I0)
N$111: IC3.8(1Q5) IC3.40(1D6) IC10.1(A:I0)
N$112: IC3.9(1Q6) IC3.38(1D7) IC10.4(B:I0)
N$113: IC3.11(1Q7) IC3.37(1D8) IC10.9(C:I0)
N$114: IC3.12(1Q8) IC3.36(2D1) IC10.12(D:I0)
N$115: IC3.13(2Q1) IC3.35(2D2) IC14.1(A:I0)
N$116: IC3.14(2Q2) IC3.33(2D3) IC14.4(B:I0)
N$117: IC3.16(2Q3) IC3.32(2D4) IC14.9(C:I0)
N$118: IC3.17(2Q4) IC3.30(2D5) IC14.12(D:I0)
N$119: IC3.19(2Q5) IC3.29(2D6) IC15.1(A:I0)
N$120: IC3.20(2Q6) IC3.27(2D7) IC15.4(B:I0)
N$121: IC3.22(2Q7) IC3.26(2D8) IC15.9(C:I0)
N$123: IC7.3(A:O) U$5.1(I1)
N$124: IC7.6(B:O) U$5.2(I2)
N$125: IC7.8(C:O) U$5.3(I3)
N$126: IC7.11(D:O) U$5.4(I4)
N$127: IC10.3(A:O) U$5.5(I5)
N$128: IC10.11(D:O) U$5.8(I8)
N$129: IC10.8(C:O) U$5.7(I7)
N$130: IC10.6(B:O) U$5.6(I6)
N$131: IC14.3(A:O) U$6.1(I1)
N$132: IC14.6(B:O) U$6.2(I2)
N$133: IC14.8(C:O) U$6.3(I3)
N$134: IC15.11(D:O) U$6.8(I8)
N$135: IC15.8(C:O) U$6.7(I7)
N$136: IC15.6(B:O) U$6.6(I6)
N$137: IC15.3(A:O) U$6.5(I5)
N$138: IC14.11(D:O) U$6.4(I4)
N$139: IC71.5(1Q3) IC71.43(1D4) IC72.9(C:I0)
N$140: IC71.6(1Q4) IC71.41(1D5) IC72.12(D:I0)
N$141: IC71.8(1Q5) IC71.40(1D6) IC73.1(A:I0)
N$143: IC16.2(1Q1) IC16.46(1D2) IC17.1(A:I0)
N$144: IC16.3(1Q2) IC16.44(1D3) IC17.4(B:I0)
N$145: IC16.5(1Q3) IC16.43(1D4) IC17.9(C:I0)
N$146: IC16.6(1Q4) IC16.41(1D5) IC17.12(D:I0)
N$147: IC16.8(1Q5) IC16.40(1D6) IC18.1(A:I0)
N$148: IC16.9(1Q6) IC16.38(1D7) IC18.4(B:I0)
N$149: IC16.11(1Q7) IC16.37(1D8) IC18.9(C:I0)
N$150: IC16.12(1Q8) IC16.36(2D1) IC18.12(D:I0)
N$151: IC16.13(2Q1) IC16.35(2D2) IC19.1(A:I0)
N$152: IC16.14(2Q2) IC16.33(2D3) IC19.4(B:I0)
N$153: IC16.16(2Q3) IC16.32(2D4) IC19.9(C:I0)
N$154: IC16.17(2Q4) IC16.30(2D5) IC19.12(D:I0)
N$155: IC16.19(2Q5) IC16.29(2D6) IC20.1(A:I0)
N$156: IC16.20(2Q6) IC16.27(2D7) IC20.4(B:I0)
N$157: IC16.22(2Q7) IC16.26(2D8) IC20.9(C:I0)
N$158: IC1.47(1D1) IC16.23(2Q8) IC20.12(D:I0)
N$160: IC17.3(A:O) U$7.1(I1)
N$161: IC17.6(B:O) U$7.2(I2)
N$162: IC17.8(C:O) U$7.3(I3)
N$163: IC17.11(D:O) U$7.4(I4)
N$164: IC18.3(A:O) U$7.5(I5)
N$165: IC18.11(D:O) U$7.8(I8)
N$166: IC18.8(C:O) U$7.7(I7)
N$167: IC18.6(B:O) U$7.6(I6)
N$168: IC19.3(A:O) U$8.1(I1)
N$169: IC19.6(B:O) U$8.2(I2)
N$170: IC19.8(C:O) U$8.3(I3)
N$171: IC20.11(D:O) U$8.8(I8)
N$172: IC20.8(C:O) U$8.7(I7)
N$173: IC20.6(B:O) U$8.6(I6)
N$174: IC20.3(A:O) U$8.5(I5)
N$175: IC19.11(D:O) U$8.4(I4)
N$176: IC3.23(2Q8) IC15.12(D:I0) IC16.47(1D1)
N$177: IC71.9(1Q6) IC71.38(1D7) IC73.4(B:I0)
N$178: IC71.11(1Q7) IC71.37(1D8) IC73.9(C:I0)
N$179: U$5.18(O1) X1.1
N$180: U$5.17(O2) X1.3
N$181: U$5.16(O3) X1.5
N$182: U$5.15(O4) X1.7
N$183: U$5.14(O5) X1.9
N$184: U$5.13(O6) X1.11
N$185: U$5.12(O7) X1.13
N$186: U$5.11(O8) X1.15
N$187: U$6.18(O1) X1.17
N$188: U$6.17(O2) X1.19
N$189: U$6.16(O3) X1.21
N$190: U$6.15(O4) X1.23
N$191: U$6.14(O5) X1.25
N$192: U$6.13(O6) X1.27
N$193: U$6.12(O7) X1.29
N$194: U$6.11(O8) X1.31
N$195: U$8.11(O8) X1.32
N$196: U$8.12(O7) X1.30
N$197: U$8.13(O6) X1.28
N$198: U$8.14(O5) X1.26
N$199: U$8.15(O4) X1.24
N$200: U$8.16(O3) X1.22
N$201: U$8.17(O2) X1.20
N$202: U$8.18(O1) X1.18
N$203: U$7.11(O8) X1.16
N$204: U$7.12(O7) X1.14
N$205: U$7.13(O6) X1.12
N$206: U$7.14(O5) X1.10
N$207: U$7.15(O4) X1.8
N$208: U$7.16(O3) X1.6
N$209: U$7.17(O2) X1.4
N$210: U$7.18(O1) X1.2
N$212: IC21.2(1Q1) IC21.46(1D2) IC22.1(A:I0)
N$213: IC21.3(1Q2) IC21.44(1D3) IC22.4(B:I0)
N$214: IC21.5(1Q3) IC21.43(1D4) IC22.9(C:I0)
N$215: IC21.6(1Q4) IC21.41(1D5) IC22.12(D:I0)
N$216: IC21.8(1Q5) IC21.40(1D6) IC23.1(A:I0)
N$217: IC21.9(1Q6) IC21.38(1D7) IC23.4(B:I0)
N$218: IC21.11(1Q7) IC21.37(1D8) IC23.9(C:I0)
N$219: IC21.12(1Q8) IC21.36(2D1) IC23.12(D:I0)
N$220: IC21.13(2Q1) IC21.35(2D2) IC24.1(A:I0)
N$221: IC21.14(2Q2) IC21.33(2D3) IC24.4(B:I0)
N$222: IC21.16(2Q3) IC21.32(2D4) IC24.9(C:I0)
N$223: IC21.17(2Q4) IC21.30(2D5) IC24.12(D:I0)
N$224: IC21.19(2Q5) IC21.29(2D6) IC25.1(A:I0)
N$225: IC21.20(2Q6) IC21.27(2D7) IC25.4(B:I0)
N$226: IC21.22(2Q7) IC21.26(2D8) IC25.9(C:I0)
N$228: IC22.3(A:O) U$9.1(I1)
N$229: IC22.6(B:O) U$9.2(I2)
N$230: IC22.8(C:O) U$9.3(I3)
N$231: IC22.11(D:O) U$9.4(I4)
N$232: IC23.3(A:O) U$9.5(I5)
N$233: IC23.11(D:O) U$9.8(I8)
N$234: IC23.8(C:O) U$9.7(I7)
N$235: IC23.6(B:O) U$9.6(I6)
N$236: IC24.3(A:O) U$10.1(I1)
N$237: IC24.6(B:O) U$10.2(I2)
N$238: IC24.8(C:O) U$10.3(I3)
N$239: IC25.11(D:O) U$10.8(I8)
N$240: IC25.8(C:O) U$10.7(I7)
N$241: IC25.6(B:O) U$10.6(I6)
N$242: IC25.3(A:O) U$10.5(I5)
N$243: IC24.11(D:O) U$10.4(I4)
N$244: IC21.47(1D1) X11.4
N$245: IC71.12(1Q8) IC71.36(2D1) IC73.12(D:I0)
N$246: IC71.13(2Q1) IC71.35(2D2) IC74.1(A:I0)
N$248: IC26.2(1Q1) IC26.46(1D2) IC27.1(A:I0)
N$249: IC26.3(1Q2) IC26.44(1D3) IC27.4(B:I0)
N$250: IC26.5(1Q3) IC26.43(1D4) IC27.9(C:I0)
N$251: IC26.6(1Q4) IC26.41(1D5) IC27.12(D:I0)
N$252: IC26.8(1Q5) IC26.40(1D6) IC28.1(A:I0)
N$253: IC26.9(1Q6) IC26.38(1D7) IC28.4(B:I0)
N$254: IC26.11(1Q7) IC26.37(1D8) IC28.9(C:I0)
N$255: IC26.12(1Q8) IC26.36(2D1) IC28.12(D:I0)
N$256: IC26.13(2Q1) IC26.35(2D2) IC29.1(A:I0)
N$257: IC26.14(2Q2) IC26.33(2D3) IC29.4(B:I0)
N$258: IC26.16(2Q3) IC26.32(2D4) IC29.9(C:I0)
N$259: IC26.17(2Q4) IC26.30(2D5) IC29.12(D:I0)
N$260: IC26.19(2Q5) IC26.29(2D6) IC30.1(A:I0)
N$261: IC26.20(2Q6) IC26.27(2D7) IC30.4(B:I0)
N$262: IC26.22(2Q7) IC26.26(2D8) IC30.9(C:I0)
N$263: IC3.47(1D1) IC26.23(2Q8) IC30.12(D:I0)
N$265: IC27.3(A:O) U$11.1(I1)
N$266: IC27.6(B:O) U$11.2(I2)
N$267: IC27.8(C:O) U$11.3(I3)
N$268: IC27.11(D:O) U$11.4(I4)
N$269: IC28.3(A:O) U$11.5(I5)
N$270: IC28.11(D:O) U$11.8(I8)
N$271: IC28.8(C:O) U$11.7(I7)
N$272: IC28.6(B:O) U$11.6(I6)
N$273: IC29.3(A:O) U$12.1(I1)
N$274: IC29.6(B:O) U$12.2(I2)
N$275: IC29.8(C:O) U$12.3(I3)
N$276: IC30.11(D:O) U$12.8(I8)
N$277: IC30.8(C:O) U$12.7(I7)
N$278: IC30.6(B:O) U$12.6(I6)
N$279: IC30.3(A:O) U$12.5(I5)
N$280: IC29.11(D:O) U$12.4(I4)
N$281: IC21.23(2Q8) IC25.12(D:I0) IC26.47(1D1)
N$282: IC71.14(2Q2) IC71.33(2D3) IC74.4(B:I0)
N$283: IC71.16(2Q3) IC71.32(2D4) IC74.9(C:I0)
N$284: U$9.18(O1) X3.1
N$285: U$9.17(O2) X3.3
N$286: U$9.16(O3) X3.5
N$287: U$9.15(O4) X3.7
N$288: U$9.14(O5) X3.9
N$289: U$9.13(O6) X3.11
N$290: U$9.12(O7) X3.13
N$291: U$9.11(O8) X3.15
N$292: U$10.18(O1) X3.17
N$293: U$10.17(O2) X3.19
N$294: U$10.16(O3) X3.21
N$295: U$10.15(O4) X3.23
N$296: U$10.14(O5) X3.25
N$297: U$10.13(O6) X3.27
N$298: U$10.12(O7) X3.29
N$299: U$10.11(O8) X3.31
N$300: U$12.11(O8) X3.32
N$301: U$12.12(O7) X3.30
N$302: U$12.13(O6) X3.28
N$303: U$12.14(O5) X3.26
N$304: U$12.15(O4) X3.24
N$305: U$12.16(O3) X3.22
N$306: U$12.17(O2) X3.20
N$307: U$12.18(O1) X3.18
N$308: U$11.11(O8) X3.16
N$309: U$11.12(O7) X3.14
N$310: U$11.13(O6) X3.12
N$311: U$11.14(O5) X3.10
N$312: U$11.15(O4) X3.8
N$313: U$11.16(O3) X3.6
N$314: U$11.17(O2) X3.4
N$315: U$11.18(O1) X3.2
N$317: IC31.2(1Q1) IC31.46(1D2) IC32.1(A:I0)
N$318: IC31.3(1Q2) IC31.44(1D3) IC32.4(B:I0)
N$319: IC31.5(1Q3) IC31.43(1D4) IC32.9(C:I0)
N$320: IC31.6(1Q4) IC31.41(1D5) IC32.12(D:I0)
N$321: IC31.8(1Q5) IC31.40(1D6) IC33.1(A:I0)
N$322: IC31.9(1Q6) IC31.38(1D7) IC33.4(B:I0)
N$323: IC31.11(1Q7) IC31.37(1D8) IC33.9(C:I0)
N$324: IC31.12(1Q8) IC31.36(2D1) IC33.12(D:I0)
N$325: IC31.13(2Q1) IC31.35(2D2) IC34.1(A:I0)
N$326: IC31.14(2Q2) IC31.33(2D3) IC34.4(B:I0)
N$327: IC31.16(2Q3) IC31.32(2D4) IC34.9(C:I0)
N$328: IC31.17(2Q4) IC31.30(2D5) IC34.12(D:I0)
N$329: IC31.19(2Q5) IC31.29(2D6) IC35.1(A:I0)
N$330: IC31.20(2Q6) IC31.27(2D7) IC35.4(B:I0)
N$331: IC31.22(2Q7) IC31.26(2D8) IC35.9(C:I0)
N$333: IC32.3(A:O) U$13.1(I1)
N$334: IC32.6(B:O) U$13.2(I2)
N$335: IC32.8(C:O) U$13.3(I3)
N$336: IC32.11(D:O) U$13.4(I4)
N$337: IC33.3(A:O) U$13.5(I5)
N$338: IC33.11(D:O) U$13.8(I8)
N$339: IC33.8(C:O) U$13.7(I7)
N$340: IC33.6(B:O) U$13.6(I6)
N$341: IC34.3(A:O) U$14.1(I1)
N$342: IC34.6(B:O) U$14.2(I2)
N$343: IC34.8(C:O) U$14.3(I3)
N$344: IC35.11(D:O) U$14.8(I8)
N$345: IC35.8(C:O) U$14.7(I7)
N$346: IC35.6(B:O) U$14.6(I6)
N$347: IC35.3(A:O) U$14.5(I5)
N$348: IC34.11(D:O) U$14.4(I4)
N$349: IC71.17(2Q4) IC71.30(2D5) IC74.12(D:I0)
N$350: IC71.19(2Q5) IC71.29(2D6) IC75.1(A:I0)
N$351: IC71.20(2Q6) IC71.27(2D7) IC75.4(B:I0)
N$353: IC36.2(1Q1) IC36.46(1D2) IC37.1(A:I0)
N$354: IC36.3(1Q2) IC36.44(1D3) IC37.4(B:I0)
N$355: IC36.5(1Q3) IC36.43(1D4) IC37.9(C:I0)
N$356: IC36.6(1Q4) IC36.41(1D5) IC37.12(D:I0)
N$357: IC36.8(1Q5) IC36.40(1D6) IC38.1(A:I0)
N$358: IC36.9(1Q6) IC36.38(1D7) IC38.4(B:I0)
N$359: IC36.11(1Q7) IC36.37(1D8) IC38.9(C:I0)
N$360: IC36.12(1Q8) IC36.36(2D1) IC38.12(D:I0)
N$361: IC36.13(2Q1) IC36.35(2D2) IC39.1(A:I0)
N$362: IC36.14(2Q2) IC36.33(2D3) IC39.4(B:I0)
N$363: IC36.16(2Q3) IC36.32(2D4) IC39.9(C:I0)
N$364: IC36.17(2Q4) IC36.30(2D5) IC39.12(D:I0)
N$365: IC36.19(2Q5) IC36.29(2D6) IC40.1(A:I0)
N$366: IC36.20(2Q6) IC36.27(2D7) IC40.4(B:I0)
N$367: IC36.22(2Q7) IC36.26(2D8) IC40.9(C:I0)
N$368: IC36.23(2Q8) IC40.12(D:I0) X11.2
N$370: IC37.3(A:O) U$15.1(I1)
N$371: IC37.6(B:O) U$15.2(I2)
N$372: IC37.8(C:O) U$15.3(I3)
N$373: IC37.11(D:O) U$15.4(I4)
N$374: IC38.3(A:O) U$15.5(I5)
N$375: IC38.11(D:O) U$15.8(I8)
N$376: IC38.8(C:O) U$15.7(I7)
N$377: IC38.6(B:O) U$15.6(I6)
N$378: IC39.3(A:O) U$16.1(I1)
N$379: IC39.6(B:O) U$16.2(I2)
N$380: IC39.8(C:O) U$16.3(I3)
N$381: IC40.11(D:O) U$16.8(I8)
N$382: IC40.8(C:O) U$16.7(I7)
N$383: IC40.6(B:O) U$16.6(I6)
N$384: IC40.3(A:O) U$16.5(I5)
N$385: IC39.11(D:O) U$16.4(I4)
N$386: IC31.23(2Q8) IC35.12(D:I0) IC36.47(1D1)
N$387: IC71.22(2Q7) IC71.26(2D8) IC75.9(C:I0)
N$389: U$13.18(O1) X4.1
N$390: U$13.17(O2) X4.3
N$391: U$13.16(O3) X4.5
N$392: U$13.15(O4) X4.7
N$393: U$13.14(O5) X4.9
N$394: U$13.13(O6) X4.11
N$395: U$13.12(O7) X4.13
N$396: U$13.11(O8) X4.15
N$397: U$14.18(O1) X4.17
N$398: U$14.17(O2) X4.19
N$399: U$14.16(O3) X4.21
N$400: U$14.15(O4) X4.23
N$401: U$14.14(O5) X4.25
N$402: U$14.13(O6) X4.27
N$403: U$14.12(O7) X4.29
N$404: U$14.11(O8) X4.31
N$405: U$16.11(O8) X4.32
N$406: U$16.12(O7) X4.30
N$407: U$16.13(O6) X4.28
N$408: U$16.14(O5) X4.26
N$409: U$16.15(O4) X4.24
N$410: U$16.16(O3) X4.22
N$411: U$16.17(O2) X4.20
N$412: U$16.18(O1) X4.18
N$413: U$15.11(O8) X4.16
N$414: U$15.12(O7) X4.14
N$415: U$15.13(O6) X4.12
N$416: U$15.14(O5) X4.10
N$417: U$15.15(O4) X4.8
N$418: U$15.16(O3) X4.6
N$419: U$15.17(O2) X4.4
N$420: U$15.18(O1) X4.2
N$422: IC41.2(1Q1) IC41.46(1D2) IC42.1(A:I0)
N$423: IC41.3(1Q2) IC41.44(1D3) IC42.4(B:I0)
N$424: IC41.5(1Q3) IC41.43(1D4) IC42.9(C:I0)
N$425: IC41.6(1Q4) IC41.41(1D5) IC42.12(D:I0)
N$426: IC41.8(1Q5) IC41.40(1D6) IC43.1(A:I0)
N$427: IC41.9(1Q6) IC41.38(1D7) IC43.4(B:I0)
N$428: IC41.11(1Q7) IC41.37(1D8) IC43.9(C:I0)
N$429: IC41.12(1Q8) IC41.36(2D1) IC43.12(D:I0)
N$430: IC41.13(2Q1) IC41.35(2D2) IC44.1(A:I0)
N$431: IC41.14(2Q2) IC41.33(2D3) IC44.4(B:I0)
N$432: IC41.16(2Q3) IC41.32(2D4) IC44.9(C:I0)
N$433: IC41.17(2Q4) IC41.30(2D5) IC44.12(D:I0)
N$434: IC41.19(2Q5) IC41.29(2D6) IC45.1(A:I0)
N$435: IC41.20(2Q6) IC41.27(2D7) IC45.4(B:I0)
N$436: IC41.22(2Q7) IC41.26(2D8) IC45.9(C:I0)
N$438: IC42.3(A:O) U$17.1(I1)
N$439: IC42.6(B:O) U$17.2(I2)
N$440: IC42.8(C:O) U$17.3(I3)
N$441: IC42.11(D:O) U$17.4(I4)
N$442: IC43.3(A:O) U$17.5(I5)
N$443: IC43.11(D:O) U$17.8(I8)
N$444: IC43.8(C:O) U$17.7(I7)
N$445: IC43.6(B:O) U$17.6(I6)
N$446: IC44.3(A:O) U$18.1(I1)
N$447: IC44.6(B:O) U$18.2(I2)
N$448: IC44.8(C:O) U$18.3(I3)
N$449: IC45.11(D:O) U$18.8(I8)
N$450: IC45.8(C:O) U$18.7(I7)
N$451: IC45.6(B:O) U$18.6(I6)
N$452: IC45.3(A:O) U$18.5(I5)
N$453: IC44.11(D:O) U$18.4(I4)
N$455: IC72.3(A:O) U$29.1(I1)
N$456: IC72.6(B:O) U$29.2(I2)
N$458: IC46.2(1Q1) IC46.46(1D2) IC47.1(A:I0)
N$459: IC46.3(1Q2) IC46.44(1D3) IC47.4(B:I0)
N$460: IC46.5(1Q3) IC46.43(1D4) IC47.9(C:I0)
N$461: IC46.6(1Q4) IC46.41(1D5) IC47.12(D:I0)
N$462: IC46.8(1Q5) IC46.40(1D6) IC48.1(A:I0)
N$463: IC46.9(1Q6) IC46.38(1D7) IC48.4(B:I0)
N$464: IC46.11(1Q7) IC46.37(1D8) IC48.9(C:I0)
N$465: IC46.12(1Q8) IC46.36(2D1) IC48.12(D:I0)
N$466: IC46.13(2Q1) IC46.35(2D2) IC49.1(A:I0)
N$467: IC46.14(2Q2) IC46.33(2D3) IC49.4(B:I0)
N$468: IC46.16(2Q3) IC46.32(2D4) IC49.9(C:I0)
N$469: IC46.17(2Q4) IC46.30(2D5) IC49.12(D:I0)
N$470: IC46.19(2Q5) IC46.29(2D6) IC50.1(A:I0)
N$471: IC46.20(2Q6) IC46.27(2D7) IC50.4(B:I0)
N$472: IC46.22(2Q7) IC46.26(2D8) IC50.9(C:I0)
N$473: IC46.23(2Q8) IC50.12(D:I0) IC91.47(1D1)
N$475: IC47.3(A:O) U$19.1(I1)
N$476: IC47.6(B:O) U$19.2(I2)
N$477: IC47.8(C:O) U$19.3(I3)
N$478: IC47.11(D:O) U$19.4(I4)
N$479: IC48.3(A:O) U$19.5(I5)
N$480: IC48.11(D:O) U$19.8(I8)
N$481: IC48.8(C:O) U$19.7(I7)
N$482: IC48.6(B:O) U$19.6(I6)
N$483: IC49.3(A:O) U$20.1(I1)
N$484: IC49.6(B:O) U$20.2(I2)
N$485: IC49.8(C:O) U$20.3(I3)
N$486: IC50.11(D:O) U$20.8(I8)
N$487: IC50.8(C:O) U$20.7(I7)
N$488: IC50.6(B:O) U$20.6(I6)
N$489: IC50.3(A:O) U$20.5(I5)
N$490: IC49.11(D:O) U$20.4(I4)
N$491: IC41.23(2Q8) IC45.12(D:I0) IC46.47(1D1)
N$492: IC72.8(C:O) U$29.3(I3)
N$493: IC72.11(D:O) U$29.4(I4)
N$494: U$17.18(O1) X5.1
N$495: U$17.17(O2) X5.3
N$496: U$17.16(O3) X5.5
N$497: U$17.15(O4) X5.7
N$498: U$17.14(O5) X5.9
N$499: U$17.13(O6) X5.11
N$500: U$17.12(O7) X5.13
N$501: U$17.11(O8) X5.15
N$502: U$18.18(O1) X5.17
N$503: U$18.17(O2) X5.19
N$504: U$18.16(O3) X5.21
N$505: U$18.15(O4) X5.23
N$506: U$18.14(O5) X5.25
N$507: U$18.13(O6) X5.27
N$508: U$18.12(O7) X5.29
N$509: U$18.11(O8) X5.31
N$510: U$20.11(O8) X5.32
N$511: U$20.12(O7) X5.30
N$512: U$20.13(O6) X5.28
N$513: U$20.14(O5) X5.26
N$514: U$20.15(O4) X5.24
N$515: U$20.16(O3) X5.22
N$516: U$20.17(O2) X5.20
N$517: U$20.18(O1) X5.18
N$518: U$19.11(O8) X5.16
N$519: U$19.12(O7) X5.14
N$520: U$19.13(O6) X5.12
N$521: U$19.14(O5) X5.10
N$522: U$19.15(O4) X5.8
N$523: U$19.16(O3) X5.6
N$524: U$19.17(O2) X5.4
N$525: U$19.18(O1) X5.2
N$527: IC51.2(1Q1) IC51.46(1D2) IC52.1(A:I0)
N$528: IC51.3(1Q2) IC51.44(1D3) IC52.4(B:I0)
N$529: IC51.5(1Q3) IC51.43(1D4) IC52.9(C:I0)
N$530: IC51.6(1Q4) IC51.41(1D5) IC52.12(D:I0)
N$531: IC51.8(1Q5) IC51.40(1D6) IC53.1(A:I0)
N$532: IC51.9(1Q6) IC51.38(1D7) IC53.4(B:I0)
N$533: IC51.11(1Q7) IC51.37(1D8) IC53.9(C:I0)
N$534: IC51.12(1Q8) IC51.36(2D1) IC53.12(D:I0)
N$535: IC51.13(2Q1) IC51.35(2D2) IC54.1(A:I0)
N$536: IC51.14(2Q2) IC51.33(2D3) IC54.4(B:I0)
N$537: IC51.16(2Q3) IC51.32(2D4) IC54.9(C:I0)
N$538: IC51.17(2Q4) IC51.30(2D5) IC54.12(D:I0)
N$539: IC51.19(2Q5) IC51.29(2D6) IC55.1(A:I0)
N$540: IC51.20(2Q6) IC51.27(2D7) IC55.4(B:I0)
N$541: IC51.22(2Q7) IC51.26(2D8) IC55.9(C:I0)
N$543: IC52.3(A:O) U$21.1(I1)
N$544: IC52.6(B:O) U$21.2(I2)
N$545: IC52.8(C:O) U$21.3(I3)
N$546: IC52.11(D:O) U$21.4(I4)
N$547: IC53.3(A:O) U$21.5(I5)
N$548: IC53.11(D:O) U$21.8(I8)
N$549: IC53.8(C:O) U$21.7(I7)
N$550: IC53.6(B:O) U$21.6(I6)
N$551: IC54.3(A:O) U$22.1(I1)
N$552: IC54.6(B:O) U$22.2(I2)
N$553: IC54.8(C:O) U$22.3(I3)
N$554: IC55.11(D:O) U$22.8(I8)
N$555: IC55.8(C:O) U$22.7(I7)
N$556: IC55.6(B:O) U$22.6(I6)
N$557: IC55.3(A:O) U$22.5(I5)
N$558: IC54.11(D:O) U$22.4(I4)
N$559: IC73.3(A:O) U$29.5(I5)
N$560: IC73.11(D:O) U$29.8(I8)
N$561: IC73.8(C:O) U$29.7(I7)
N$563: IC56.2(1Q1) IC56.46(1D2) IC57.1(A:I0)
N$564: IC56.3(1Q2) IC56.44(1D3) IC57.4(B:I0)
N$565: IC56.5(1Q3) IC56.43(1D4) IC57.9(C:I0)
N$566: IC56.6(1Q4) IC56.41(1D5) IC57.12(D:I0)
N$567: IC56.8(1Q5) IC56.40(1D6) IC58.1(A:I0)
N$568: IC56.9(1Q6) IC56.38(1D7) IC58.4(B:I0)
N$569: IC56.11(1Q7) IC56.37(1D8) IC58.9(C:I0)
N$570: IC56.12(1Q8) IC56.36(2D1) IC58.12(D:I0)
N$571: IC56.13(2Q1) IC56.35(2D2) IC59.1(A:I0)
N$572: IC56.14(2Q2) IC56.33(2D3) IC59.4(B:I0)
N$573: IC56.16(2Q3) IC56.32(2D4) IC59.9(C:I0)
N$574: IC56.17(2Q4) IC56.30(2D5) IC59.12(D:I0)
N$575: IC56.19(2Q5) IC56.29(2D6) IC60.1(A:I0)
N$576: IC56.20(2Q6) IC56.27(2D7) IC60.4(B:I0)
N$577: IC56.22(2Q7) IC56.26(2D8) IC60.9(C:I0)
N$578: IC41.47(1D1) IC56.23(2Q8) IC60.12(D:I0)
N$580: IC57.3(A:O) U$23.1(I1)
N$581: IC57.6(B:O) U$23.2(I2)
N$582: IC57.8(C:O) U$23.3(I3)
N$583: IC57.11(D:O) U$23.4(I4)
N$584: IC58.3(A:O) U$23.5(I5)
N$585: IC58.11(D:O) U$23.8(I8)
N$586: IC58.8(C:O) U$23.7(I7)
N$587: IC58.6(B:O) U$23.6(I6)
N$588: IC59.3(A:O) U$24.1(I1)
N$589: IC59.6(B:O) U$24.2(I2)
N$590: IC59.8(C:O) U$24.3(I3)
N$591: IC60.11(D:O) U$24.8(I8)
N$592: IC60.8(C:O) U$24.7(I7)
N$593: IC60.6(B:O) U$24.6(I6)
N$594: IC60.3(A:O) U$24.5(I5)
N$595: IC59.11(D:O) U$24.4(I4)
N$596: IC51.23(2Q8) IC55.12(D:I0) IC56.47(1D1)
N$597: IC73.6(B:O) U$29.6(I6)
N$598: IC74.3(A:O) U$30.1(I1)
N$599: U$21.18(O1) X6.1
N$600: U$21.17(O2) X6.3
N$601: U$21.16(O3) X6.5
N$602: U$21.15(O4) X6.7
N$603: U$21.14(O5) X6.9
N$604: U$21.13(O6) X6.11
N$605: U$21.12(O7) X6.13
N$606: U$21.11(O8) X6.15
N$607: U$22.18(O1) X6.17
N$608: U$22.17(O2) X6.19
N$609: U$22.16(O3) X6.21
N$610: U$22.15(O4) X6.23
N$611: U$22.14(O5) X6.25
N$612: U$22.13(O6) X6.27
N$613: U$22.12(O7) X6.29
N$614: U$22.11(O8) X6.31
N$615: U$24.11(O8) X6.32
N$616: U$24.12(O7) X6.30
N$617: U$24.13(O6) X6.28
N$618: U$24.14(O5) X6.26
N$619: U$24.15(O4) X6.24
N$620: U$24.16(O3) X6.22
N$621: U$24.17(O2) X6.20
N$622: U$24.18(O1) X6.18
N$623: U$23.11(O8) X6.16
N$624: U$23.12(O7) X6.14
N$625: U$23.13(O6) X6.12
N$626: U$23.14(O5) X6.10
N$627: U$23.15(O4) X6.8
N$628: U$23.16(O3) X6.6
N$629: U$23.17(O2) X6.4
N$630: U$23.18(O1) X6.2
N$632: IC61.2(1Q1) IC61.46(1D2) IC62.1(A:I0)
N$633: IC61.3(1Q2) IC61.44(1D3) IC62.4(B:I0)
N$634: IC61.5(1Q3) IC61.43(1D4) IC62.9(C:I0)
N$635: IC61.6(1Q4) IC61.41(1D5) IC62.12(D:I0)
N$636: IC61.8(1Q5) IC61.40(1D6) IC63.1(A:I0)
N$637: IC61.9(1Q6) IC61.38(1D7) IC63.4(B:I0)
N$638: IC61.11(1Q7) IC61.37(1D8) IC63.9(C:I0)
N$639: IC61.12(1Q8) IC61.36(2D1) IC63.12(D:I0)
N$640: IC61.13(2Q1) IC61.35(2D2) IC64.1(A:I0)
N$641: IC61.14(2Q2) IC61.33(2D3) IC64.4(B:I0)
N$642: IC61.16(2Q3) IC61.32(2D4) IC64.9(C:I0)
N$643: IC61.17(2Q4) IC61.30(2D5) IC64.12(D:I0)
N$644: IC61.19(2Q5) IC61.29(2D6) IC65.1(A:I0)
N$645: IC61.20(2Q6) IC61.27(2D7) IC65.4(B:I0)
N$646: IC61.22(2Q7) IC61.26(2D8) IC65.9(C:I0)
N$648: IC62.3(A:O) U$25.1(I1)
N$649: IC62.6(B:O) U$25.2(I2)
N$650: IC62.8(C:O) U$25.3(I3)
N$651: IC62.11(D:O) U$25.4(I4)
N$652: IC63.3(A:O) U$25.5(I5)
N$653: IC63.11(D:O) U$25.8(I8)
N$654: IC63.8(C:O) U$25.7(I7)
N$655: IC63.6(B:O) U$25.6(I6)
N$656: IC64.3(A:O) U$26.1(I1)
N$657: IC64.6(B:O) U$26.2(I2)
N$658: IC64.8(C:O) U$26.3(I3)
N$659: IC65.11(D:O) U$26.8(I8)
N$660: IC65.8(C:O) U$26.7(I7)
N$661: IC65.6(B:O) U$26.6(I6)
N$662: IC65.3(A:O) U$26.5(I5)
N$663: IC64.11(D:O) U$26.4(I4)
N$664: IC74.6(B:O) U$30.2(I2)
N$665: IC74.8(C:O) U$30.3(I3)
N$666: IC75.11(D:O) U$30.8(I8)
N$668: IC66.2(1Q1) IC66.46(1D2) IC67.1(A:I0)
N$669: IC66.3(1Q2) IC66.44(1D3) IC67.4(B:I0)
N$670: IC66.5(1Q3) IC66.43(1D4) IC67.9(C:I0)
N$671: IC66.6(1Q4) IC66.41(1D5) IC67.12(D:I0)
N$672: IC66.8(1Q5) IC66.40(1D6) IC68.1(A:I0)
N$673: IC66.9(1Q6) IC66.38(1D7) IC68.4(B:I0)
N$674: IC66.11(1Q7) IC66.37(1D8) IC68.9(C:I0)
N$675: IC66.12(1Q8) IC66.36(2D1) IC68.12(D:I0)
N$676: IC66.13(2Q1) IC66.35(2D2) IC69.1(A:I0)
N$677: IC66.14(2Q2) IC66.33(2D3) IC69.4(B:I0)
N$678: IC66.16(2Q3) IC66.32(2D4) IC69.9(C:I0)
N$679: IC66.17(2Q4) IC66.30(2D5) IC69.12(D:I0)
N$680: IC66.19(2Q5) IC66.29(2D6) IC70.1(A:I0)
N$681: IC66.20(2Q6) IC66.27(2D7) IC70.4(B:I0)
N$682: IC66.22(2Q7) IC66.26(2D8) IC70.9(C:I0)
N$683: IC31.47(1D1) IC66.23(2Q8) IC70.12(D:I0)
N$685: IC67.3(A:O) U$27.1(I1)
N$686: IC67.6(B:O) U$27.2(I2)
N$687: IC67.8(C:O) U$27.3(I3)
N$688: IC67.11(D:O) U$27.4(I4)
N$689: IC68.3(A:O) U$27.5(I5)
N$690: IC68.11(D:O) U$27.8(I8)
N$691: IC68.8(C:O) U$27.7(I7)
N$692: IC68.6(B:O) U$27.6(I6)
N$693: IC69.3(A:O) U$28.1(I1)
N$694: IC69.6(B:O) U$28.2(I2)
N$695: IC69.8(C:O) U$28.3(I3)
N$696: IC70.11(D:O) U$28.8(I8)
N$697: IC70.8(C:O) U$28.7(I7)
N$698: IC70.6(B:O) U$28.6(I6)
N$699: IC70.3(A:O) U$28.5(I5)
N$700: IC69.11(D:O) U$28.4(I4)
N$701: IC61.23(2Q8) IC65.12(D:I0) IC66.47(1D1)
N$702: IC75.8(C:O) U$30.7(I7)
N$703: IC75.6(B:O) U$30.6(I6)
N$704: U$25.18(O1) X7.1
N$705: U$25.17(O2) X7.3
N$706: U$25.16(O3) X7.5
N$707: U$25.15(O4) X7.7
N$708: U$25.14(O5) X7.9
N$709: U$25.13(O6) X7.11
N$710: U$25.12(O7) X7.13
N$711: U$25.11(O8) X7.15
N$712: U$26.18(O1) X7.17
N$713: U$26.17(O2) X7.19
N$714: U$26.16(O3) X7.21
N$715: U$26.15(O4) X7.23
N$716: U$26.14(O5) X7.25
N$717: U$26.13(O6) X7.27
N$718: U$26.12(O7) X7.29
N$719: U$26.11(O8) X7.31
N$720: U$28.11(O8) X7.32
N$721: U$28.12(O7) X7.30
N$722: U$28.13(O6) X7.28
N$723: U$28.14(O5) X7.26
N$724: U$28.15(O4) X7.24
N$725: U$28.16(O3) X7.22
N$726: U$28.17(O2) X7.20
N$727: U$28.18(O1) X7.18
N$728: U$27.11(O8) X7.16
N$729: U$27.12(O7) X7.14
N$730: U$27.13(O6) X7.12
N$731: U$27.14(O5) X7.10
N$732: U$27.15(O4) X7.8
N$733: U$27.16(O3) X7.6
N$734: U$27.17(O2) X7.4
N$735: U$27.18(O1) X7.2
N$736: IC75.3(A:O) U$30.5(I5)
N$737: IC74.11(D:O) U$30.4(I4)
N$739: IC76.2(1Q1) IC76.46(1D2) IC77.1(A:I0)
N$740: IC76.3(1Q2) IC76.44(1D3) IC77.4(B:I0)
N$741: IC76.5(1Q3) IC76.43(1D4) IC77.9(C:I0)
N$742: IC76.6(1Q4) IC76.41(1D5) IC77.12(D:I0)
N$743: IC76.8(1Q5) IC76.40(1D6) IC78.1(A:I0)
N$744: IC76.9(1Q6) IC76.38(1D7) IC78.4(B:I0)
N$745: IC76.11(1Q7) IC76.37(1D8) IC78.9(C:I0)
N$746: IC76.12(1Q8) IC76.36(2D1) IC78.12(D:I0)
N$747: IC76.13(2Q1) IC76.35(2D2) IC79.1(A:I0)
N$748: IC76.14(2Q2) IC76.33(2D3) IC79.4(B:I0)
N$749: IC76.16(2Q3) IC76.32(2D4) IC79.9(C:I0)
N$750: IC76.17(2Q4) IC76.30(2D5) IC79.12(D:I0)
N$751: IC76.19(2Q5) IC76.29(2D6) IC80.1(A:I0)
N$752: IC76.20(2Q6) IC76.27(2D7) IC80.4(B:I0)
N$753: IC76.22(2Q7) IC76.26(2D8) IC80.9(C:I0)
N$754: IC61.47(1D1) IC76.23(2Q8) IC80.12(D:I0)
N$756: IC77.3(A:O) U$31.1(I1)
N$757: IC77.6(B:O) U$31.2(I2)
N$758: IC77.8(C:O) U$31.3(I3)
N$759: IC77.11(D:O) U$31.4(I4)
N$760: IC78.3(A:O) U$31.5(I5)
N$761: IC78.11(D:O) U$31.8(I8)
N$762: IC78.8(C:O) U$31.7(I7)
N$763: IC78.6(B:O) U$31.6(I6)
N$764: IC79.3(A:O) U$32.1(I1)
N$765: IC79.6(B:O) U$32.2(I2)
N$766: IC79.8(C:O) U$32.3(I3)
N$767: IC80.11(D:O) U$32.8(I8)
N$768: IC80.8(C:O) U$32.7(I7)
N$769: IC80.6(B:O) U$32.6(I6)
N$770: IC80.3(A:O) U$32.5(I5)
N$771: IC79.11(D:O) U$32.4(I4)
N$772: IC71.23(2Q8) IC75.12(D:I0) IC76.47(1D1)
N$773: U$29.18(O1) X8.1
N$774: U$29.17(O2) X8.3
N$775: U$29.16(O3) X8.5
N$776: U$29.15(O4) X8.7
N$777: U$29.14(O5) X8.9
N$778: U$29.13(O6) X8.11
N$779: U$29.12(O7) X8.13
N$780: U$29.11(O8) X8.15
N$781: U$30.18(O1) X8.17
N$782: U$30.17(O2) X8.19
N$783: U$30.16(O3) X8.21
N$784: U$30.15(O4) X8.23
N$785: U$30.14(O5) X8.25
N$786: U$30.13(O6) X8.27
N$787: U$30.12(O7) X8.29
N$788: U$30.11(O8) X8.31
N$789: U$32.11(O8) X8.32
N$790: U$32.12(O7) X8.30
N$791: U$32.13(O6) X8.28
N$792: U$32.14(O5) X8.26
N$793: U$32.15(O4) X8.24
N$794: U$32.16(O3) X8.22
N$795: U$32.17(O2) X8.20
N$796: U$32.18(O1) X8.18
N$797: U$31.11(O8) X8.16
N$798: U$31.12(O7) X8.14
N$799: U$31.13(O6) X8.12
N$800: U$31.14(O5) X8.10
N$801: U$31.15(O4) X8.8
N$802: U$31.16(O3) X8.6
N$803: U$31.17(O2) X8.4
N$804: U$31.18(O1) X8.2
N$806: IC81.2(1Q1) IC81.46(1D2) IC82.1(A:I0)
N$807: IC81.3(1Q2) IC81.44(1D3) IC82.4(B:I0)
N$808: IC81.5(1Q3) IC81.43(1D4) IC82.9(C:I0)
N$809: IC81.6(1Q4) IC81.41(1D5) IC82.12(D:I0)
N$810: IC81.8(1Q5) IC81.40(1D6) IC83.1(A:I0)
N$811: IC81.9(1Q6) IC81.38(1D7) IC83.4(B:I0)
N$812: IC81.11(1Q7) IC81.37(1D8) IC83.9(C:I0)
N$813: IC81.12(1Q8) IC81.36(2D1) IC83.12(D:I0)
N$814: IC81.13(2Q1) IC81.35(2D2) IC84.1(A:I0)
N$815: IC81.14(2Q2) IC81.33(2D3) IC84.4(B:I0)
N$816: IC81.16(2Q3) IC81.32(2D4) IC84.9(C:I0)
N$817: IC81.17(2Q4) IC81.30(2D5) IC84.12(D:I0)
N$818: IC81.19(2Q5) IC81.29(2D6) IC85.1(A:I0)
N$819: IC81.20(2Q6) IC81.27(2D7) IC85.4(B:I0)
N$820: IC81.22(2Q7) IC81.26(2D8) IC85.9(C:I0)
N$822: IC82.3(A:O) U$33.1(I1)
N$823: IC82.6(B:O) U$33.2(I2)
N$824: IC82.8(C:O) U$33.3(I3)
N$825: IC82.11(D:O) U$33.4(I4)
N$826: IC83.3(A:O) U$33.5(I5)
N$827: IC83.11(D:O) U$33.8(I8)
N$828: IC83.8(C:O) U$33.7(I7)
N$829: IC83.6(B:O) U$33.6(I6)
N$830: IC84.3(A:O) U$34.1(I1)
N$831: IC84.6(B:O) U$34.2(I2)
N$832: IC84.8(C:O) U$34.3(I3)
N$833: IC85.11(D:O) U$34.8(I8)
N$834: IC85.8(C:O) U$34.7(I7)
N$835: IC85.6(B:O) U$34.6(I6)
N$836: IC85.3(A:O) U$34.5(I5)
N$837: IC84.11(D:O) U$34.4(I4)
N$839: IC86.2(1Q1) IC86.46(1D2) IC87.1(A:I0)
N$840: IC86.3(1Q2) IC86.44(1D3) IC87.4(B:I0)
N$841: IC86.5(1Q3) IC86.43(1D4) IC87.9(C:I0)
N$842: IC86.6(1Q4) IC86.41(1D5) IC87.12(D:I0)
N$843: IC86.8(1Q5) IC86.40(1D6) IC88.1(A:I0)
N$844: IC86.9(1Q6) IC86.38(1D7) IC88.4(B:I0)
N$845: IC86.11(1Q7) IC86.37(1D8) IC88.9(C:I0)
N$846: IC86.12(1Q8) IC86.36(2D1) IC88.12(D:I0)
N$847: IC86.13(2Q1) IC86.35(2D2) IC89.1(A:I0)
N$848: IC86.14(2Q2) IC86.33(2D3) IC89.4(B:I0)
N$849: IC86.16(2Q3) IC86.32(2D4) IC89.9(C:I0)
N$850: IC86.17(2Q4) IC86.30(2D5) IC89.12(D:I0)
N$851: IC86.19(2Q5) IC86.29(2D6) IC90.1(A:I0)
N$852: IC86.20(2Q6) IC86.27(2D7) IC90.4(B:I0)
N$853: IC86.22(2Q7) IC86.26(2D8) IC90.9(C:I0)
N$854: IC71.47(1D1) IC86.23(2Q8) IC90.12(D:I0)
N$856: IC87.3(A:O) U$35.1(I1)
N$857: IC87.6(B:O) U$35.2(I2)
N$858: IC87.8(C:O) U$35.3(I3)
N$859: IC87.11(D:O) U$35.4(I4)
N$860: IC88.3(A:O) U$35.5(I5)
N$861: IC88.11(D:O) U$35.8(I8)
N$862: IC88.8(C:O) U$35.7(I7)
N$863: IC88.6(B:O) U$35.6(I6)
N$864: IC89.3(A:O) U$36.1(I1)
N$865: IC89.6(B:O) U$36.2(I2)
N$866: IC89.8(C:O) U$36.3(I3)
N$867: IC90.11(D:O) U$36.8(I8)
N$868: IC90.8(C:O) U$36.7(I7)
N$869: IC90.6(B:O) U$36.6(I6)
N$870: IC90.3(A:O) U$36.5(I5)
N$871: IC89.11(D:O) U$36.4(I4)
N$872: IC81.23(2Q8) IC85.12(D:I0) IC86.47(1D1)
N$873: U$33.18(O1) X9.1
N$874: U$33.17(O2) X9.3
N$875: U$33.16(O3) X9.5
N$876: U$33.15(O4) X9.7
N$877: U$33.14(O5) X9.9
N$878: U$33.13(O6) X9.11
N$879: U$33.12(O7) X9.13
N$880: U$33.11(O8) X9.15
N$881: U$34.18(O1) X9.17
N$882: U$34.17(O2) X9.19
N$883: U$34.16(O3) X9.21
N$884: U$34.15(O4) X9.23
N$885: U$34.14(O5) X9.25
N$886: U$34.13(O6) X9.27
N$887: U$34.12(O7) X9.29
N$888: U$34.11(O8) X9.31
N$889: U$36.11(O8) X9.32
N$890: U$36.12(O7) X9.30
N$891: U$36.13(O6) X9.28
N$892: U$36.14(O5) X9.26
N$893: U$36.15(O4) X9.24
N$894: U$36.16(O3) X9.22
N$895: U$36.17(O2) X9.20
N$896: U$36.18(O1) X9.18
N$897: U$35.11(O8) X9.16
N$898: U$35.12(O7) X9.14
N$899: U$35.13(O6) X9.12
N$900: U$35.14(O5) X9.10
N$901: U$35.15(O4) X9.8
N$902: U$35.16(O3) X9.6
N$903: U$35.17(O2) X9.4
N$904: U$35.18(O1) X9.2
N$906: IC91.2(1Q1) IC91.46(1D2) IC92.1(A:I0)
N$907: IC91.3(1Q2) IC91.44(1D3) IC92.4(B:I0)
N$908: IC91.5(1Q3) IC91.43(1D4) IC92.9(C:I0)
N$909: IC91.6(1Q4) IC91.41(1D5) IC92.12(D:I0)
N$910: IC91.8(1Q5) IC91.40(1D6) IC93.1(A:I0)
N$911: IC91.9(1Q6) IC91.38(1D7) IC93.4(B:I0)
N$912: IC91.11(1Q7) IC91.37(1D8) IC93.9(C:I0)
N$913: IC91.12(1Q8) IC91.36(2D1) IC93.12(D:I0)
N$914: IC91.13(2Q1) IC91.35(2D2) IC94.1(A:I0)
N$915: IC91.14(2Q2) IC91.33(2D3) IC94.4(B:I0)
N$916: IC91.16(2Q3) IC91.32(2D4) IC94.9(C:I0)
N$917: IC91.17(2Q4) IC91.30(2D5) IC94.12(D:I0)
N$918: IC91.19(2Q5) IC91.29(2D6) IC95.1(A:I0)
N$919: IC91.20(2Q6) IC91.27(2D7) IC95.4(B:I0)
N$920: IC91.22(2Q7) IC91.26(2D8) IC95.9(C:I0)
N$922: IC92.3(A:O) U$37.1(I1)
N$923: IC92.6(B:O) U$37.2(I2)
N$924: IC92.8(C:O) U$37.3(I3)
N$925: IC92.11(D:O) U$37.4(I4)
N$926: IC93.3(A:O) U$37.5(I5)
N$927: IC93.11(D:O) U$37.8(I8)
N$928: IC93.8(C:O) U$37.7(I7)
N$929: IC93.6(B:O) U$37.6(I6)
N$930: IC94.3(A:O) U$38.1(I1)
N$931: IC94.6(B:O) U$38.2(I2)
N$932: IC94.8(C:O) U$38.3(I3)
N$933: IC95.11(D:O) U$38.8(I8)
N$934: IC95.8(C:O) U$38.7(I7)
N$935: IC95.6(B:O) U$38.6(I6)
N$936: IC95.3(A:O) U$38.5(I5)
N$937: IC94.11(D:O) U$38.4(I4)
N$938: IC27.2(A:I1) IC27.5(B:I1) IC27.10(C:I1) IC27.13(D:I1) IC28.2(A:I1) IC28.5(B:I1) IC28.10(C:I1) IC28.13(D:I1) IC101.5(1Q3) IC101.43(1D4)
N$940: IC96.2(1Q1) IC96.46(1D2) IC97.1(A:I0)
N$941: IC96.3(1Q2) IC96.44(1D3) IC97.4(B:I0)
N$942: IC96.5(1Q3) IC96.43(1D4) IC97.9(C:I0)
N$943: IC96.6(1Q4) IC96.41(1D5) IC97.12(D:I0)
N$944: IC96.8(1Q5) IC96.40(1D6) IC98.1(A:I0)
N$945: IC96.9(1Q6) IC96.38(1D7) IC98.4(B:I0)
N$946: IC96.11(1Q7) IC96.37(1D8) IC98.9(C:I0)
N$947: IC96.12(1Q8) IC96.36(2D1) IC98.12(D:I0)
N$948: IC96.13(2Q1) IC96.35(2D2) IC99.1(A:I0)
N$949: IC96.14(2Q2) IC96.33(2D3) IC99.4(B:I0)
N$950: IC96.16(2Q3) IC96.32(2D4) IC99.9(C:I0)
N$951: IC96.17(2Q4) IC96.30(2D5) IC99.12(D:I0)
N$952: IC96.19(2Q5) IC96.29(2D6) IC100.1(A:I0)
N$953: IC96.20(2Q6) IC96.27(2D7) IC100.4(B:I0)
N$954: IC96.22(2Q7) IC96.26(2D8) IC100.9(C:I0)
N$955: IC81.47(1D1) IC96.23(2Q8) IC100.12(D:I0)
N$957: IC97.3(A:O) U$39.1(I1)
N$958: IC97.6(B:O) U$39.2(I2)
N$959: IC97.8(C:O) U$39.3(I3)
N$960: IC97.11(D:O) U$39.4(I4)
N$961: IC98.3(A:O) U$39.5(I5)
N$962: IC98.11(D:O) U$39.8(I8)
N$963: IC98.8(C:O) U$39.7(I7)
N$964: IC98.6(B:O) U$39.6(I6)
N$965: IC99.3(A:O) U$40.1(I1)
N$966: IC99.6(B:O) U$40.2(I2)
N$967: IC99.8(C:O) U$40.3(I3)
N$968: IC100.11(D:O) U$40.8(I8)
N$969: IC100.8(C:O) U$40.7(I7)
N$970: IC100.6(B:O) U$40.6(I6)
N$971: IC100.3(A:O) U$40.5(I5)
N$972: IC99.11(D:O) U$40.4(I4)
N$973: IC91.23(2Q8) IC95.12(D:I0) IC96.47(1D1)
N$974: U$37.18(O1) X10.1
N$975: U$37.17(O2) X10.3
N$976: U$37.16(O3) X10.5
N$977: U$37.15(O4) X10.7
N$978: U$37.14(O5) X10.9
N$979: U$37.13(O6) X10.11
N$980: U$37.12(O7) X10.13
N$981: U$37.11(O8) X10.15
N$982: U$38.18(O1) X10.17
N$983: U$38.17(O2) X10.19
N$984: U$38.16(O3) X10.21
N$985: U$38.15(O4) X10.23
N$986: U$38.14(O5) X10.25
N$987: U$38.13(O6) X10.27
N$988: U$38.12(O7) X10.29
N$989: U$38.11(O8) X10.31
N$990: U$40.11(O8) X10.32
N$991: U$40.12(O7) X10.30
N$992: U$40.13(O6) X10.28
N$993: U$40.14(O5) X10.26
N$994: U$40.15(O4) X10.24
N$995: U$40.16(O3) X10.22
N$996: U$40.17(O2) X10.20
N$997: U$40.18(O1) X10.18
N$998: U$39.11(O8) X10.16
N$999: U$39.12(O7) X10.14
N$1000: U$39.13(O6) X10.12
N$1001: U$39.14(O5) X10.10
N$1002: U$39.15(O4) X10.8
N$1003: U$39.16(O3) X10.6
N$1004: U$39.17(O2) X10.4
N$1005: U$39.18(O1) X10.2
N$1006: IC29.2(A:I1) IC29.5(B:I1) IC29.10(C:I1) IC29.13(D:I1) IC30.2(A:I1) IC30.5(B:I1) IC30.10(C:I1) IC30.13(D:I1) IC101.6(1Q4) IC101.41(1D5)
N$1008: IC7.2(A:I1) IC7.5(B:I1) IC7.10(C:I1) IC7.13(D:I1) IC10.2(A:I1) IC10.5(B:I1) IC10.10(C:I1) IC10.13(D:I1) IC101.8(1Q5) IC101.40(1D6)
N$1009: IC14.2(A:I1) IC14.5(B:I1) IC14.10(C:I1) IC14.13(D:I1) IC15.2(A:I1) IC15.5(B:I1) IC15.10(C:I1) IC15.13(D:I1) IC101.9(1Q6) IC101.38(1D7)
N$1010: IC17.2(A:I1) IC17.5(B:I1) IC17.10(C:I1) IC17.13(D:I1) IC18.2(A:I1) IC18.5(B:I1) IC18.10(C:I1) IC18.13(D:I1) IC101.11(1Q7) IC101.37(1D8)
N$1011: IC19.2(A:I1) IC19.5(B:I1) IC19.10(C:I1) IC19.13(D:I1) IC20.2(A:I1) IC20.5(B:I1) IC20.10(C:I1) IC20.13(D:I1) IC101.12(1Q8) IC101.36(2D1)
N$1012: IC2.2(A:I1) IC2.5(B:I1) IC2.10(C:I1) IC2.13(D:I1) IC4.2(A:I1) IC4.5(B:I1) IC4.10(C:I1) IC4.13(D:I1) IC101.13(2Q1) IC101.35(2D2)
N$1013: IC5.2(A:I1) IC5.5(B:I1) IC5.10(C:I1) IC5.13(D:I1) IC6.2(A:I1) IC6.5(B:I1) IC6.10(C:I1) IC6.13(D:I1) IC101.14(2Q2) IC101.33(2D3)
N$1014: IC9.2(A:I1) IC9.5(B:I1) IC9.10(C:I1) IC9.13(D:I1) IC11.2(A:I1) IC11.5(B:I1) IC11.10(C:I1) IC11.13(D:I1) IC101.16(2Q3) IC101.32(2D4)
N$1015: IC12.2(A:I1) IC12.5(B:I1) IC12.10(C:I1) IC12.13(D:I1) IC13.2(A:I1) IC13.5(B:I1) IC13.10(C:I1) IC13.13(D:I1) IC101.17(2Q4) IC101.30(2D5)
N$1016: IC52.2(A:I1) IC52.5(B:I1) IC52.10(C:I1) IC52.13(D:I1) IC53.2(A:I1) IC53.5(B:I1) IC53.10(C:I1) IC53.13(D:I1) IC101.19(2Q5) IC101.29(2D6)
N$1017: IC54.2(A:I1) IC54.5(B:I1) IC54.10(C:I1) IC54.13(D:I1) IC55.2(A:I1) IC55.5(B:I1) IC55.10(C:I1) IC55.13(D:I1) IC101.20(2Q6) IC101.27(2D7)
N$1018: IC57.2(A:I1) IC57.5(B:I1) IC57.10(C:I1) IC57.13(D:I1) IC58.2(A:I1) IC58.5(B:I1) IC58.10(C:I1) IC58.13(D:I1) IC101.22(2Q7) IC101.26(2D8)
N$1019: IC59.2(A:I1) IC59.5(B:I1) IC59.10(C:I1) IC59.13(D:I1) IC60.2(A:I1) IC60.5(B:I1) IC60.10(C:I1) IC60.13(D:I1) IC101.23(2Q8) IC102.47(1D1)
N$1020: IC101.47(1D1) X11.3
N$1021: U$1.10(CD+) U$2.10(CD+) U$3.10(CD+) U$4.10(CD+) U$5.10(CD+) U$6.10(CD+) U$7.10(CD+) U$8.10(CD+) U$9.10(CD+) U$10.10(CD+) U$11.10(CD+) U$12.10(CD+) U$13.10(CD+) U$14.10(CD+) U$15.10(CD+) U$16.10(CD+) U$17.10(CD+) U$18.10(CD+) U$19.10(CD+) U$20.10(CD+) U$21.10(CD+) U$22.10(CD+) U$23.10(CD+) U$24.10(CD+) U$25.10(CD+) U$26.10(CD+) U$27.10(CD+) U$28.10(CD+) U$29.10(CD+) U$30.10(CD+) U$31.10(CD+) U$32.10(CD+) U$33.10(CD+) U$34.10(CD+) U$35.10(CD+) U$36.10(CD+) U$37.10(CD+) U$38.10(CD+) U$39.10(CD+) U$40.10(CD+) X11.7
N$1023: IC42.2(A:I1) IC42.5(B:I1) IC42.10(C:I1) IC42.13(D:I1) IC43.2(A:I1) IC43.5(B:I1) IC43.10(C:I1) IC43.13(D:I1) IC102.2(1Q1) IC102.46(1D2)
N$1024: IC44.2(A:I1) IC44.5(B:I1) IC44.10(C:I1) IC44.13(D:I1) IC45.2(A:I1) IC45.5(B:I1) IC45.10(C:I1) IC45.13(D:I1) IC102.3(1Q2) IC102.44(1D3)
N$1025: IC47.2(A:I1) IC47.5(B:I1) IC47.10(C:I1) IC47.13(D:I1) IC48.2(A:I1) IC48.5(B:I1) IC48.10(C:I1) IC48.13(D:I1) IC102.5(1Q3) IC102.43(1D4)
N$1026: IC49.2(A:I1) IC49.5(B:I1) IC49.10(C:I1) IC49.13(D:I1) IC50.2(A:I1) IC50.5(B:I1) IC50.10(C:I1) IC50.13(D:I1) IC102.6(1Q4) IC102.41(1D5)
N$1027: IC92.2(A:I1) IC92.5(B:I1) IC92.10(C:I1) IC92.13(D:I1) IC93.2(A:I1) IC93.5(B:I1) IC93.10(C:I1) IC93.13(D:I1) IC102.8(1Q5) IC102.40(1D6)
N$1028: IC94.2(A:I1) IC94.5(B:I1) IC94.10(C:I1) IC94.13(D:I1) IC95.2(A:I1) IC95.5(B:I1) IC95.10(C:I1) IC95.13(D:I1) IC102.9(1Q6) IC102.38(1D7)
N$1029: IC97.2(A:I1) IC97.5(B:I1) IC97.10(C:I1) IC97.13(D:I1) IC98.2(A:I1) IC98.5(B:I1) IC98.10(C:I1) IC98.13(D:I1) IC102.11(1Q7) IC102.37(1D8)
N$1030: IC99.2(A:I1) IC99.5(B:I1) IC99.10(C:I1) IC99.13(D:I1) IC100.2(A:I1) IC100.5(B:I1) IC100.10(C:I1) IC100.13(D:I1) IC102.12(1Q8) IC102.36(2D1)
N$1031: IC82.2(A:I1) IC82.5(B:I1) IC82.10(C:I1) IC82.13(D:I1) IC83.2(A:I1) IC83.5(B:I1) IC83.10(C:I1) IC83.13(D:I1) IC102.13(2Q1) IC102.35(2D2)
N$1032: IC84.2(A:I1) IC84.5(B:I1) IC84.10(C:I1) IC84.13(D:I1) IC85.2(A:I1) IC85.5(B:I1) IC85.10(C:I1) IC85.13(D:I1) IC102.14(2Q2) IC102.33(2D3)
N$1033: IC87.2(A:I1) IC87.5(B:I1) IC87.10(C:I1) IC87.13(D:I1) IC88.2(A:I1) IC88.5(B:I1) IC88.10(C:I1) IC88.13(D:I1) IC102.16(2Q3) IC102.32(2D4)
N$1034: IC89.2(A:I1) IC89.5(B:I1) IC89.10(C:I1) IC89.13(D:I1) IC90.2(A:I1) IC90.5(B:I1) IC90.10(C:I1) IC90.13(D:I1) IC102.17(2Q4) IC102.30(2D5)
N$1035: IC72.2(A:I1) IC72.5(B:I1) IC72.10(C:I1) IC72.13(D:I1) IC73.2(A:I1) IC73.5(B:I1) IC73.10(C:I1) IC73.13(D:I1) IC102.19(2Q5) IC102.29(2D6)
N$1036: IC74.2(A:I1) IC74.5(B:I1) IC74.10(C:I1) IC74.13(D:I1) IC75.2(A:I1) IC75.5(B:I1) IC75.10(C:I1) IC75.13(D:I1) IC102.20(2Q6) IC102.27(2D7)
N$1037: IC77.2(A:I1) IC77.5(B:I1) IC77.10(C:I1) IC77.13(D:I1) IC78.2(A:I1) IC78.5(B:I1) IC78.10(C:I1) IC78.13(D:I1) IC102.22(2Q7) IC102.26(2D8)
N$1038: IC79.2(A:I1) IC79.5(B:I1) IC79.10(C:I1) IC79.13(D:I1) IC80.2(A:I1) IC80.5(B:I1) IC80.10(C:I1) IC80.13(D:I1) IC102.23(2Q8) IC103.47(1D1)
N$1042: IC62.2(A:I1) IC62.5(B:I1) IC62.10(C:I1) IC62.13(D:I1) IC63.2(A:I1) IC63.5(B:I1) IC63.10(C:I1) IC63.13(D:I1) IC103.2(1Q1) IC103.46(1D2)
N$1043: IC64.2(A:I1) IC64.5(B:I1) IC64.10(C:I1) IC64.13(D:I1) IC65.2(A:I1) IC65.5(B:I1) IC65.10(C:I1) IC65.13(D:I1) IC103.3(1Q2) IC103.44(1D3)
N$1044: IC67.2(A:I1) IC67.5(B:I1) IC67.10(C:I1) IC67.13(D:I1) IC68.2(A:I1) IC68.5(B:I1) IC68.10(C:I1) IC68.13(D:I1) IC103.5(1Q3) IC103.43(1D4)
N$1045: IC69.2(A:I1) IC69.5(B:I1) IC69.10(C:I1) IC69.13(D:I1) IC70.2(A:I1) IC70.5(B:I1) IC70.10(C:I1) IC70.13(D:I1) IC103.6(1Q4) IC103.41(1D5)
N$1046: IC32.2(A:I1) IC32.5(B:I1) IC32.10(C:I1) IC32.13(D:I1) IC33.2(A:I1) IC33.5(B:I1) IC33.10(C:I1) IC33.13(D:I1) IC103.8(1Q5) IC103.40(1D6)
N$1047: IC34.2(A:I1) IC34.5(B:I1) IC34.10(C:I1) IC34.13(D:I1) IC35.2(A:I1) IC35.5(B:I1) IC35.10(C:I1) IC35.13(D:I1) IC103.9(1Q6) IC103.38(1D7)
N$1048: IC37.2(A:I1) IC37.5(B:I1) IC37.10(C:I1) IC37.13(D:I1) IC38.2(A:I1) IC38.5(B:I1) IC38.10(C:I1) IC38.13(D:I1) IC103.11(1Q7) IC103.37(1D8)
N$1057: IC39.2(A:I1) IC39.5(B:I1) IC39.10(C:I1) IC39.13(D:I1) IC40.2(A:I1) IC40.5(B:I1) IC40.10(C:I1) IC40.13(D:I1) IC103.12(1Q8) IC103.36(2D1) X11.1
N$1060: IC101.25(2CLK) IC101.48(1CLK) IC102.25(2CLK) IC102.48(1CLK) IC103.25(2CLK) IC103.48(1CLK) X11.6
N$1061: IC1.25(2CLK) IC1.48(1CLK) IC3.25(2CLK) IC3.48(1CLK) IC8.25(2CLK) IC8.48(1CLK) IC16.25(2CLK) IC16.48(1CLK) IC21.25(2CLK) IC21.48(1CLK) IC26.25(2CLK) IC26.48(1CLK) IC31.25(2CLK) IC31.48(1CLK) IC36.25(2CLK) IC36.48(1CLK) IC41.25(2CLK) IC41.48(1CLK) IC46.25(2CLK) IC46.48(1CLK) IC51.25(2CLK) IC51.48(1CLK) IC56.25(2CLK) IC56.48(1CLK) IC61.25(2CLK) IC61.48(1CLK) IC66.25(2CLK) IC66.48(1CLK) IC71.25(2CLK) IC71.48(1CLK) IC76.25(2CLK) IC76.48(1CLK) IC81.25(2CLK) IC81.48(1CLK) IC86.25(2CLK) IC86.48(1CLK) IC91.25(2CLK) IC91.48(1CLK) IC96.25(2CLK) IC96.48(1CLK) X11.5
VCC: X11.8
Unconnected: IC103.13(2Q1) IC103.14(2Q2) IC103.16(2Q3) IC103.17(2Q4) IC103.19(2Q5) IC103.20(2Q6) IC103.22(2Q7) IC103.23(2Q8) IC103.26(2D8) IC103.27(2D7) IC103.29(2D6) IC103.30(2D5) IC103.32(2D4) IC103.33(2D3) IC103.35(2D2) X11.10 X11.11 X11.12 X11.13 X11.14